# EasyEDA Pro project RK3568_DEV.epro, board PCB1
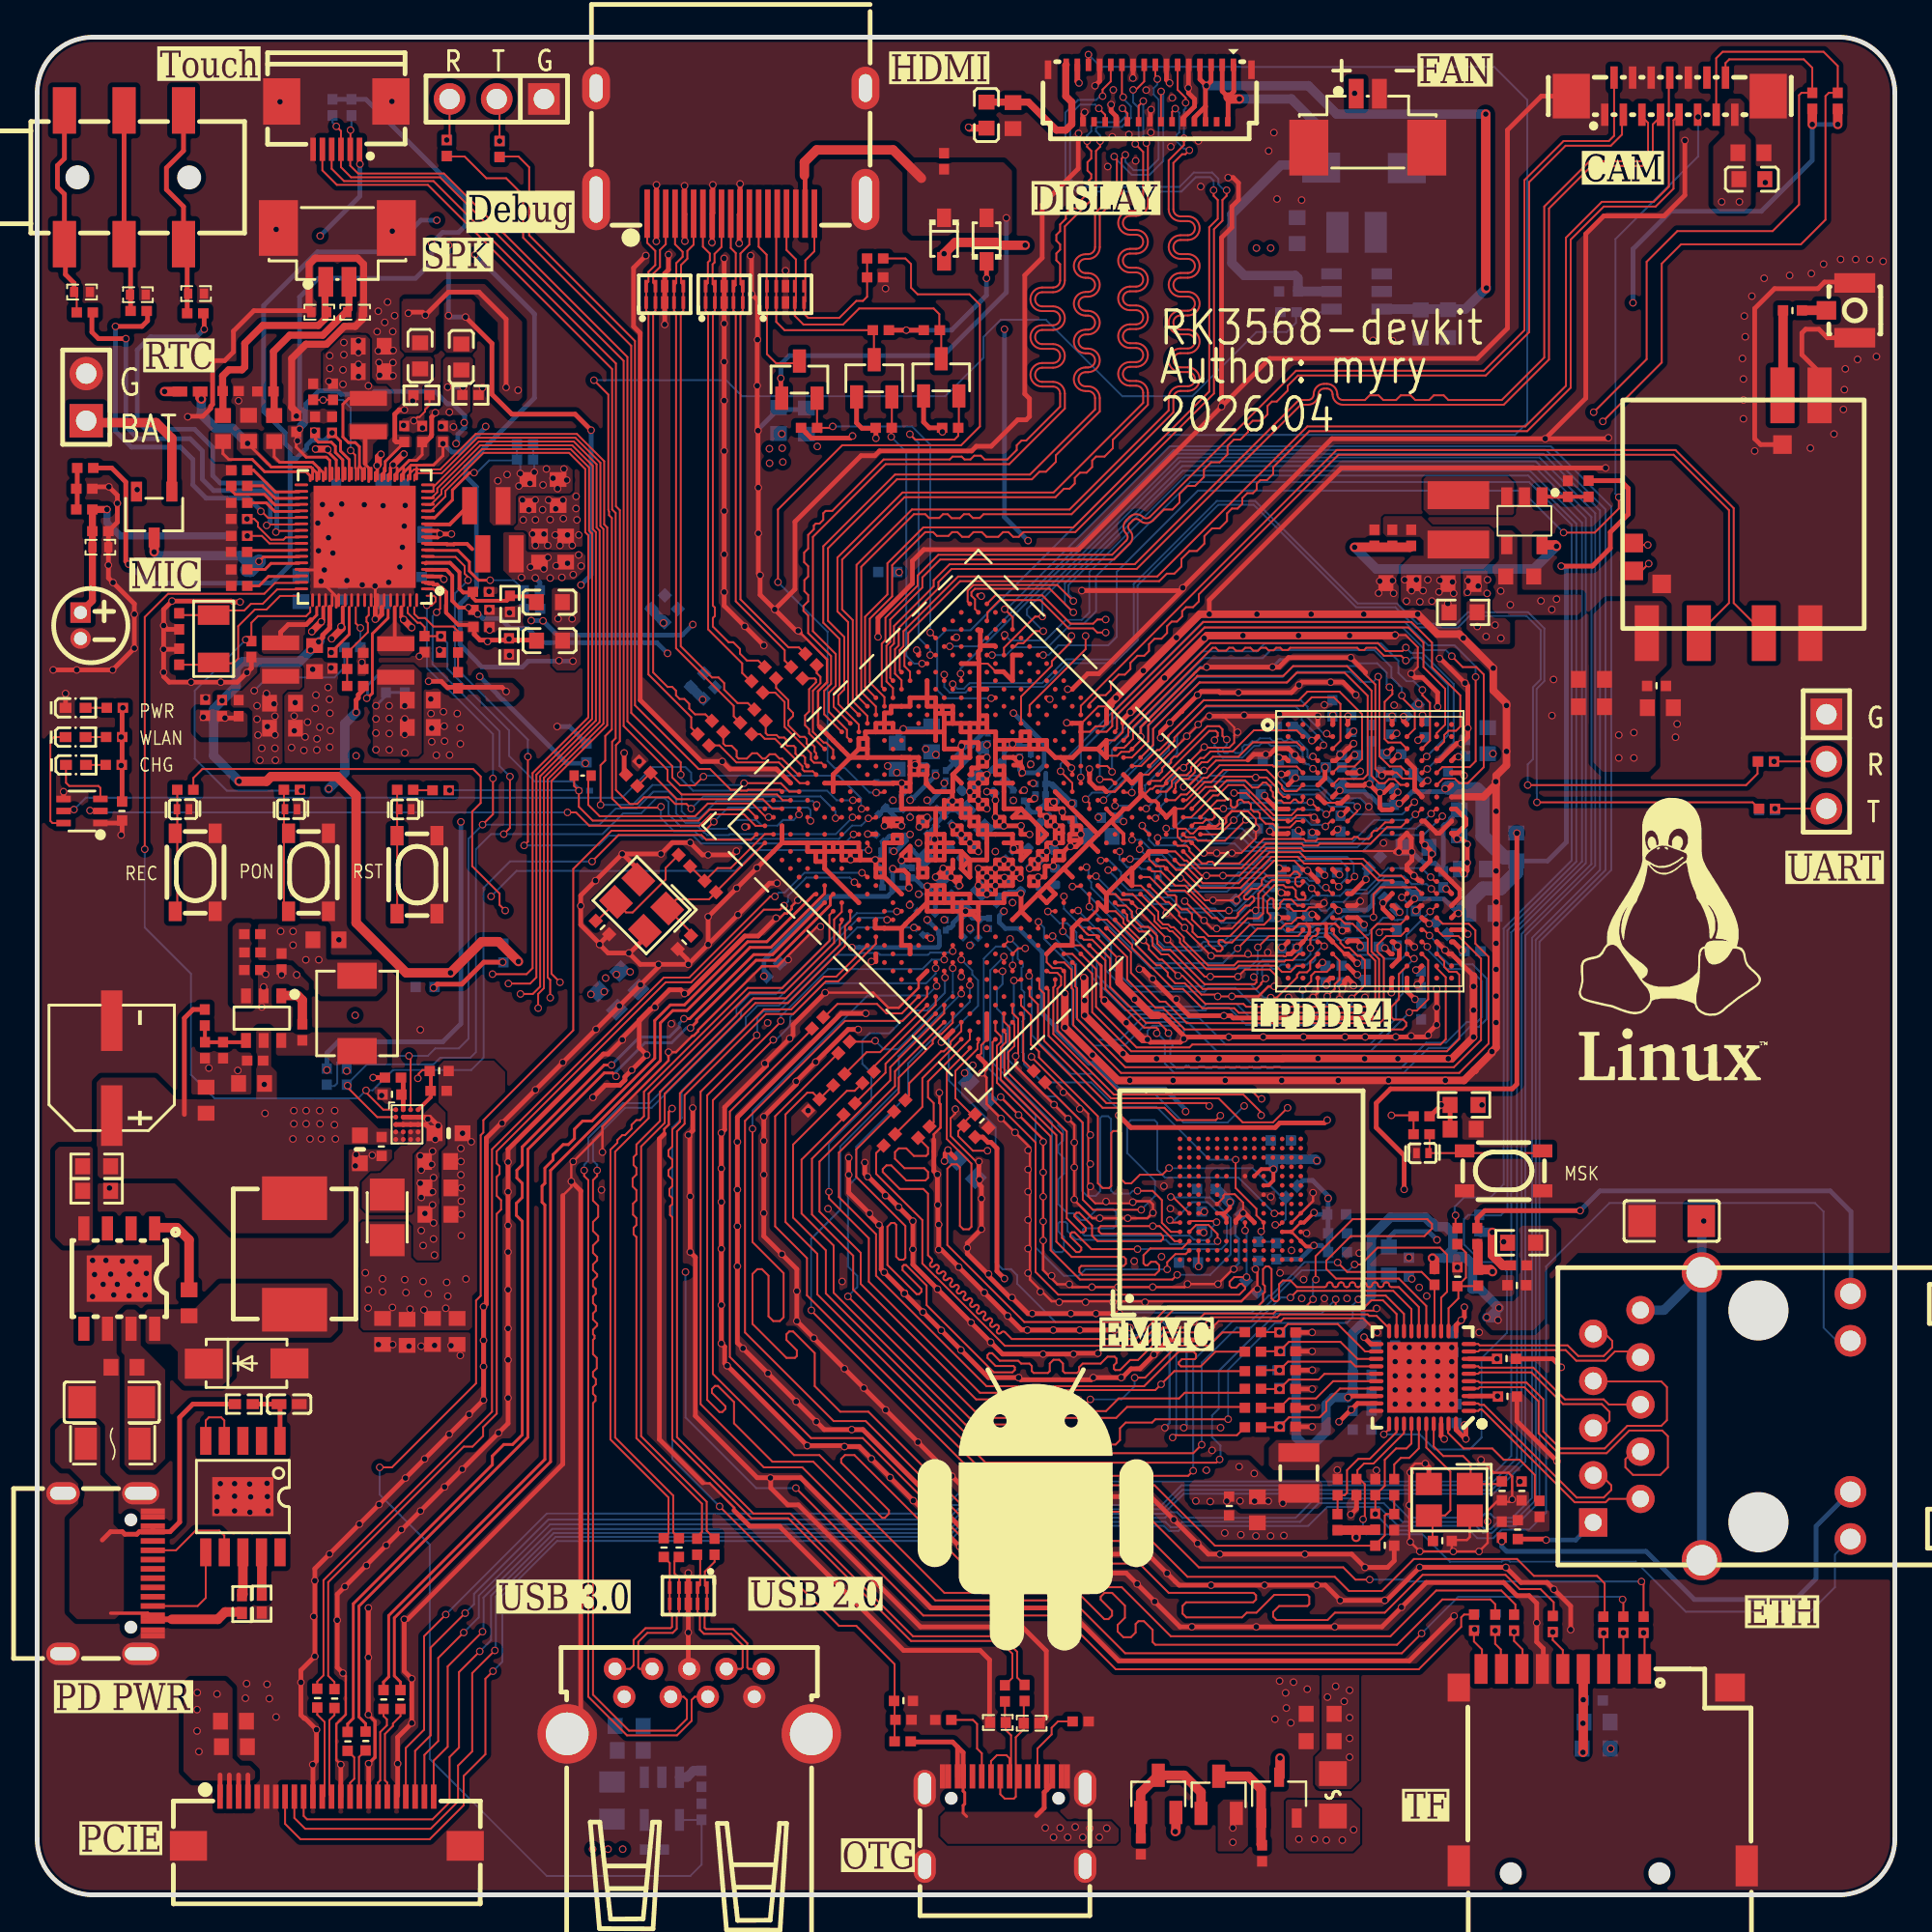
[diagram p27: board, top side]
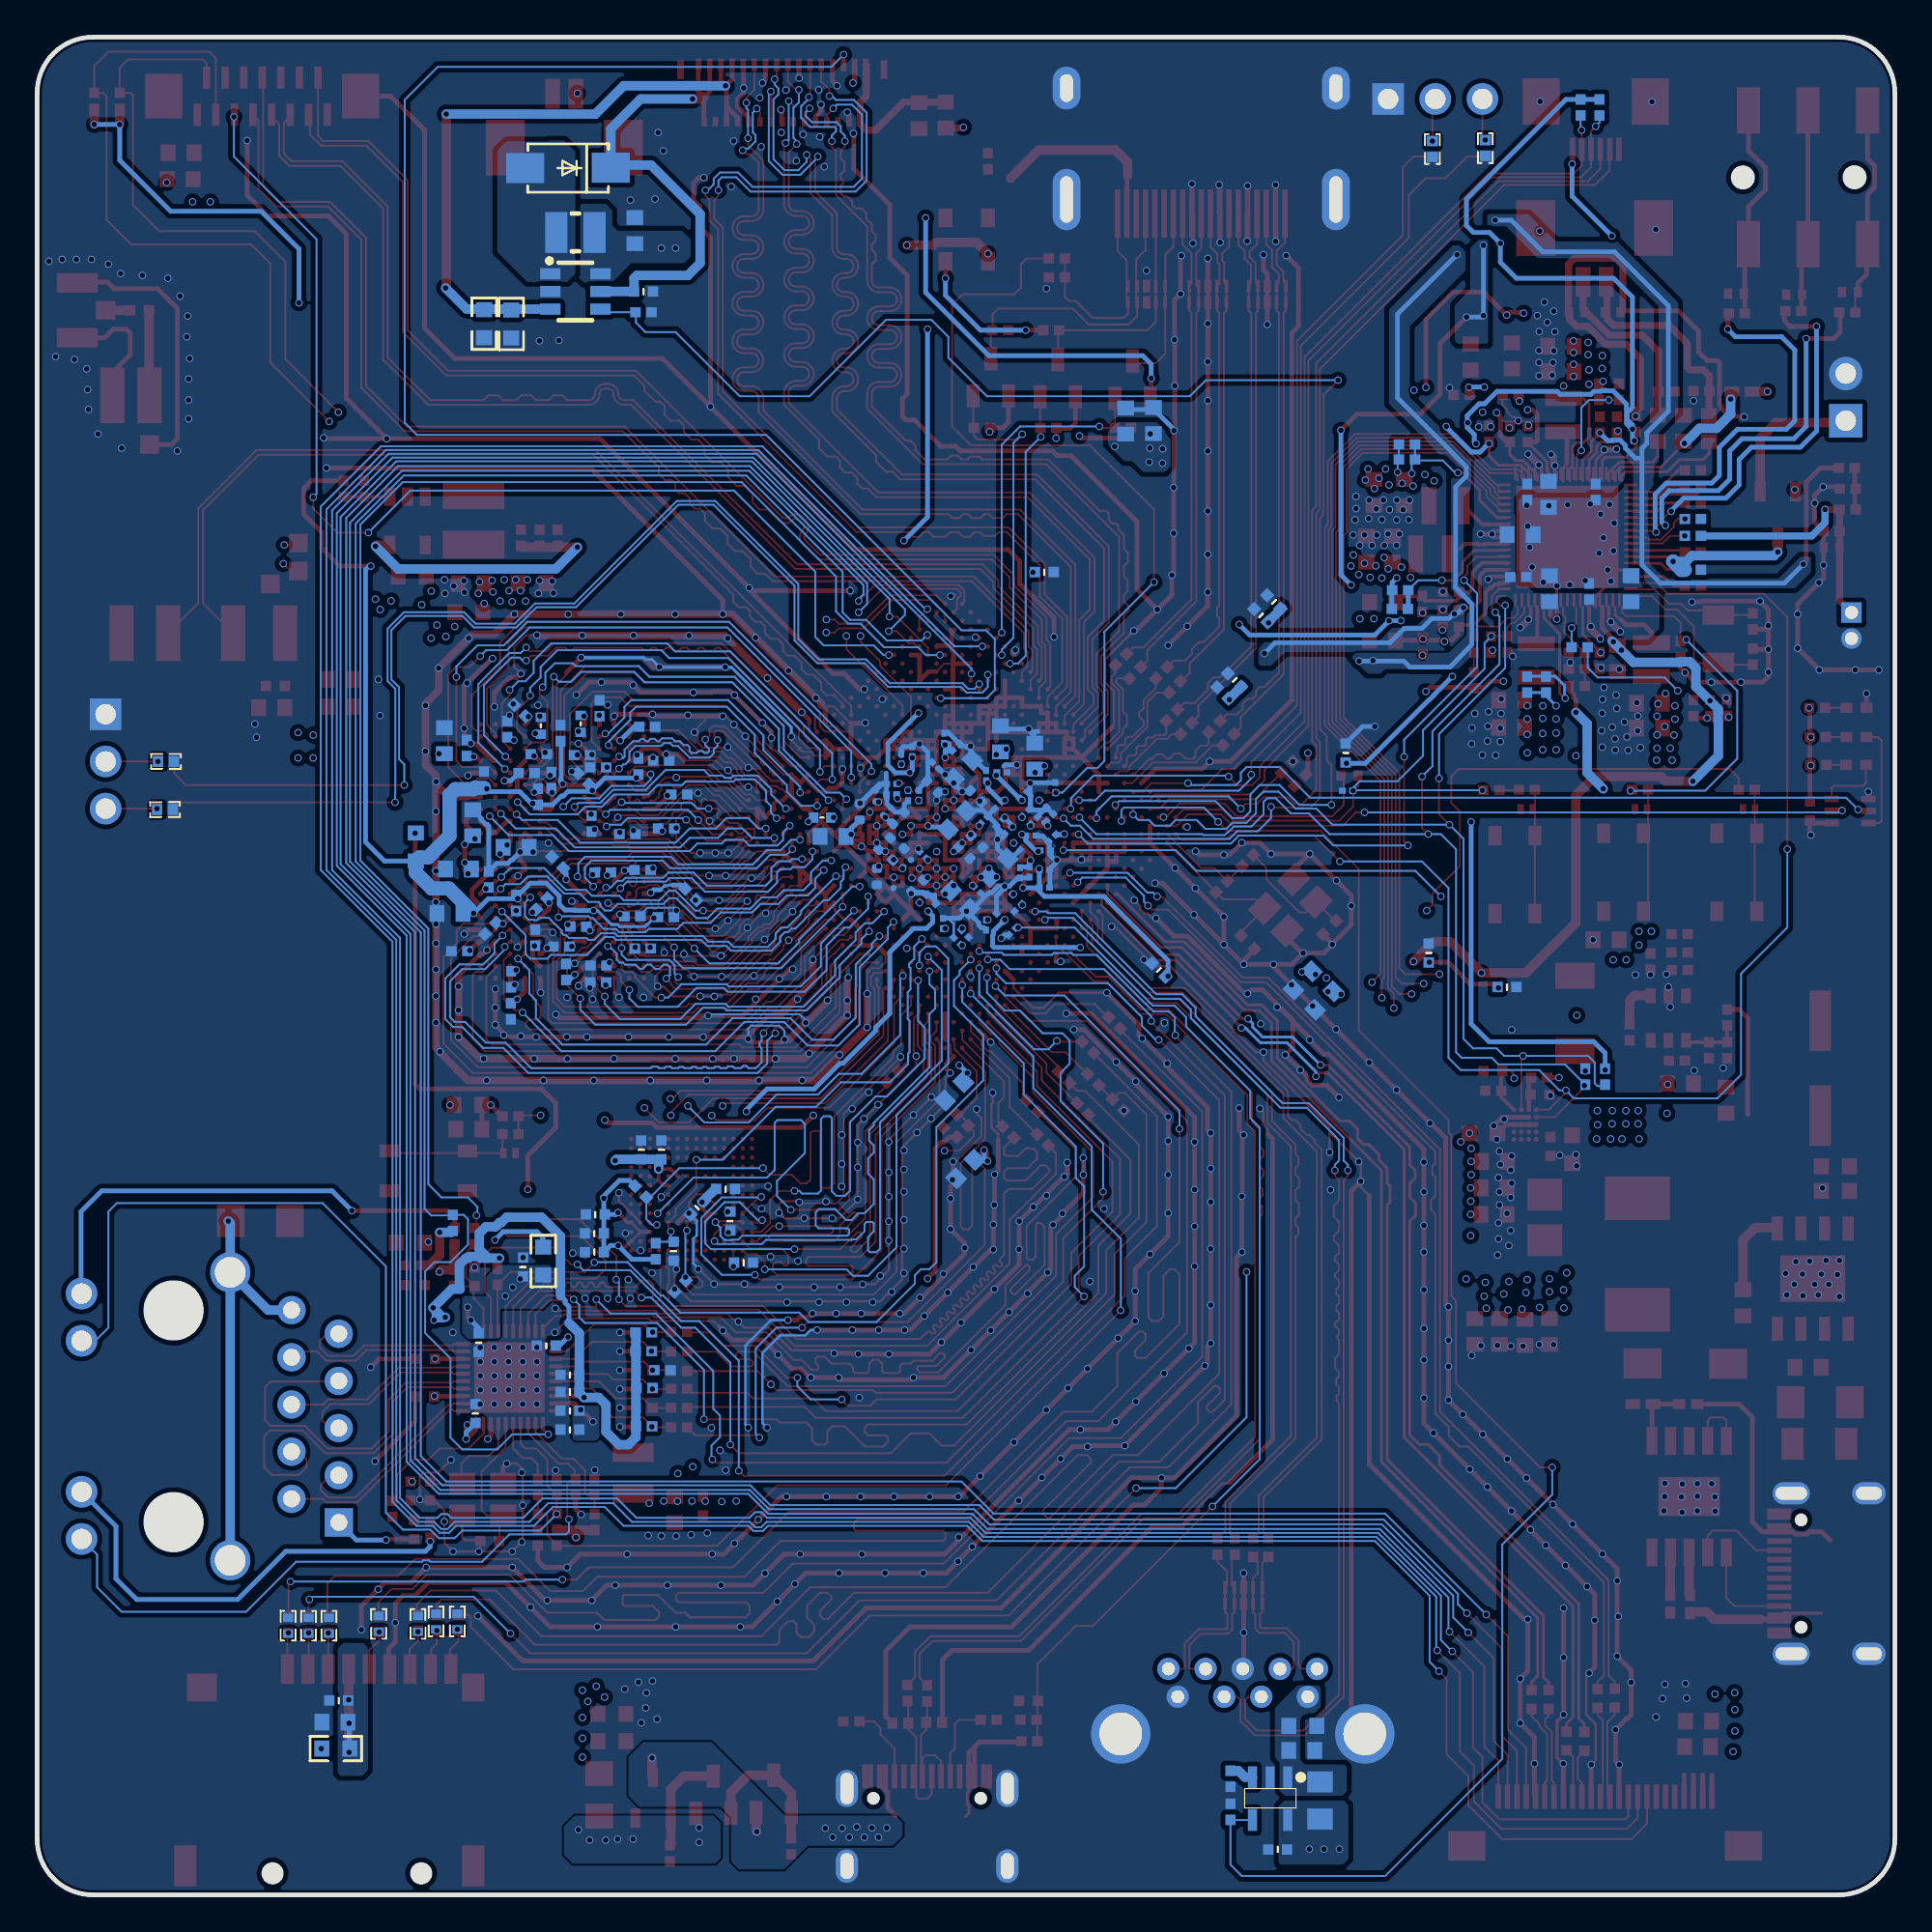
[diagram p28: board, bottom side, seen from below]

Outline 100 x 100 mm; copper layers: Top Layer, GND1, PWR, SIG, GND2, Bottom Layer. Coordinates in mm from the lower left corner of the outline.
Outline path: 0,97 0,3 arc(0.88,0.88) 3,0 97,0 arc(99.12,0.88) 100,3 100,97 arc(99.12,99.12) 97,100 3,100 arc(0.88,99.12) 0,97
Stack: Top Layer 0.035mm Outer layer thickness 1oz / Dielectric1 0.0994mm 3313 RC57% 4.2mil / GND1 0.0152mm Inner layer thickness / Dielectric2 0.55mm 0.55mm H/H No copper / PWR 0.0152mm Inner layer thickness / Dielectric3 0.1088mm 2116 RC54% 4.9mil / SIG 0.0152mm Inner layer thickness / Dielectric4 0.55mm 0.55mm H/H No copper / GND2 0.0152mm Inner layer thickness / Dielectric5 0.0994mm 3313 RC57% 4.2mil / Bottom Layer 0.035mm Outer layer thickness 1oz

## Design rules (mm)
net DDR_A0_A: DDR
net DDR_A_DQS0N: DDR, DP2
net DDR_A_DQS0P: DDR, DP2
net DDR_DM0_A: DDR
net DDR_DQ0_A: DDR
net DDR_DQ1_A: DDR
net DDR_DQ2_A: DDR
net DDR_DQ3_A: DDR
net DDR_DQ4_A: DDR
net DDR_DQ5_A: DDR
net DDR_DQ6_A: DDR
net DDR_DQ7_A: DDR
net DDR_B_DQS0N: DDR, DP5
net DDR_B_DQS0P: DDR, DP5
net DDR_DM0_B: DDR
net DDR_DQ0_B: DDR
net DDR_DQ1_B: DDR
net DDR_DQ2_B: DDR
net DDR_DQ3_B: DDR
net DDR_DQ4_B: DDR
net DDR_DQ5_B: DDR
net DDR_DQ6_B: DDR
net DDR_DQ7_B: DDR
net DDR_A_DQS1N: DDR, DP1
net DDR_A_DQS1P: DDR, DP1
net DDR_DM1_A: DDR
net DDR_DQ8_A: DDR
net DDR_DQ9_A: DDR
net DDR_DQ10_A: DDR
net DDR_DQ11_A: DDR
net DDR_DQ12_A: DDR
net DDR_DQ13_A: DDR
net DDR_DQ14_A: DDR
net DDR_DQ15_A: DDR
net DDR_B_DQS1N: DDR, DP6
net DDR_B_DQS1P: DDR, DP6
net DDR_DM1_B: DDR
net DDR_DQ8_B: DDR
net DDR_DQ9_B: DDR
net DDR_DQ10_B: DDR
net DDR_DQ11_B: DDR
net DDR_DQ12_B: DDR
net DDR_DQ13_B: DDR
net DDR_DQ14_B: DDR
net DDR_DQ15_B: DDR
net DDR_A1_A: DDR
net DDR_A2_A: DDR
net DDR_A3_A: DDR
net DDR_A4_A: DDR
net DDR_A5_A: DDR
net DDR_A_CKE0: DDR
net DDR_A_CKE1: DDR
net DDR_A_CLKN: DDR, DP3
net DDR_A_CLKP: DDR, DP3
net DDR_A_CS0: DDR
net DDR_A_CS1: DDR
net DDR_A_ODTCA: DDR
net DDR_A0_B: DDR
net DDR_A1_B: DDR
net DDR_A2_B: DDR
net DDR_A3_B: DDR
net DDR_A4_B: DDR
net DDR_A5_B: DDR
net DDR_B_CKE0: DDR
net DDR_B_CKE1: DDR
net DDR_B_CLKN: DDR, DP4
net DDR_B_CLKP: DDR, DP4
net DDR_B_CS0: DDR
net DDR_B_CS1: DDR
net DDR_B_ODTCA: DDR
net DDR_RESET: DDR
net CAM0_DN0: DP26
net CAM0_DN1: DP27
net CAM0_DP0: DP26
net CAM0_DP1: DP27
net CAM0_CKN: DP28
net CAM0_CKP: DP28
net HDMI_TX0N_PORT: DP19
net HDMI_TX0P_PORT: DP19
net HDMI_TX1N_PORT: DP18
net HDMI_TX1P_PORT: DP18
net HDMI_TX2N_PORT: DP17
net HDMI_TX2P_PORT: DP17
net HDMI_TXCLKN_PORT: DP20
net HDMI_TXCLKP_PORT: DP20
net LCD_CKN: DP23
net LCD_CKP: DP23
net LCD_D0N: DP21
net LCD_D0P: DP21
net LCD_D1N: DP22
net LCD_D1P: DP22
net LCD_D2N: DP24
net LCD_D2P: DP24
net LCD_D3N: DP25
net LCD_D3P: DP25
net PCIE20_REFCLKN: DP13
net PCIE20_REFCLKP: DP13
net PCIE20_RXN: DP12
net PCIE20_RXP: DP12
net PCIE20_TXN: DP11
net PCIE20_TXP: DP11
net PHY0_MDI_0-: DP10
net PHY0_MDI_0+: DP10
net PHY0_MDI_1-: DP9
net PHY0_MDI_1+: DP9
net PHY0_MDI_2-: DP8
net PHY0_MDI_2+: DP8
net PHY0_MDI_3-: DP7
net PHY0_MDI_3+: DP7
net TYPEC_DM: DP31
net TYPEC_DP: DP31
net USB2_HOST2_DM: DP29
net USB2_HOST2_DP: DP29
net USB3_HOST1_DM: DP36
net USB3_HOST1_DP: DP36
net USB3_HOST1_SSRXN: DP32
net USB3_HOST1_SSRXN_M: DP35
net USB3_HOST1_SSRXP: DP32
net USB3_HOST1_SSRXP_M: DP35
net USB3_HOST1_SSTXN: DP33
net USB3_HOST1_SSTXN_M: DP34
net USB3_HOST1_SSTXP: DP33
net USB3_HOST1_SSTXP_M: DP34
net USB3_OTG0_DM: DP30
net USB3_OTG0_DP: DP30
net $29N965: DP14
net $29N963: DP14
net $29N961: DP15
net $29N959: DP15
net $29N957: DP16
net $29N955: DP16
spacing copperThickness1oz (default): track to track 0.102, other pairs 0.102 to 0.3
spacing copperThickness2oz: track to track 0.203, other pairs 0.152 to 0.3
spacing PWR: track to track 0.102, other pairs 0.102 to 0.3
track width copperThickness1oz (default): min 0.102, default 0.254, max 2.54
track width copperThickness2oz: min 0.203, default 0.254, max 2.54
track width GNDVCC: min 0.102, default 0.254, max 2.54
differential pair differentialPair (default): width min 0.102, default 0.102, max 2.54; gap min 0.152, default 0.152
differential pair PCIE: width min 0.102, default 0.152, max 2.54; gap min 0.152, default 0.203
net GND uses GNDVCC, copperRegion_copperThickness1oz
net MIPI_AVDD_0V9 uses copperRegion_copperThickness1oz
net MIPI_AVDD_1V8 uses copperRegion_copperThickness1oz
net MIPI_CSI_RX_CLK1N uses default
net MIPI_CSI_RX_CLK1P uses default
net MIPI_CSI_RX_D2N uses default
net MIPI_CSI_RX_D2P uses default
net MIPI_CSI_RX_D3N uses default
net MIPI_CSI_RX_D3P uses default
net PCIE20_RXN uses PCIE
net PCIE20_RXP uses PCIE
net PCIE20_TXN uses PCIE
net PCIE20_TXP uses PCIE
net USB_AVDD_0V9 uses copperRegion_copperThickness1oz
net USB_AVDD_1V8 uses copperRegion_copperThickness1oz
net VCC0V6_DDR uses GNDVCC, copperRegion_copperThickness1oz
net VCC1V8_DDR uses GNDVCC
net VCC3V0_RTC uses GNDVCC
net VCC3V3_PHY0 uses GNDVCC
net VCC3V3_PMU uses GNDVCC, copperRegion_copperThickness1oz
net VCC3V3_SD uses GNDVCC, copperRegion_copperThickness1oz
net VCC3V3_SYS uses GNDVCC, PWR, copperRegion_PWR
net VCC_1V8 uses copperRegion_copperThickness1oz
net VCC_3V3 uses copperRegion_copperThickness1oz
net VCC_DDR uses GNDVCC
net VCC-5V uses copperRegion_copperThickness1oz
net VCCA1V8_IMAGE uses GNDVCC, copperRegion_copperThickness1oz
net VCCA1V8_PMU uses GNDVCC, copperRegion_copperThickness1oz
net VCCA_1V8 uses GNDVCC, copperRegion_copperThickness1oz
net VCCIO_ACODEC uses GNDVCC, copperRegion_copperThickness1oz
net VCCIO_FLASH uses GNDVCC
net VCCIO_PHY0 uses GNDVCC, copperRegion_copperThickness1oz
net VCCIO_SD uses GNDVCC, copperRegion_copperThickness1oz
net VCCIO_WL uses GNDVCC, copperRegion_copperThickness1oz
net VDD10_PHY0 uses copperRegion_copperThickness1oz
net VDD_CPU uses GNDVCC
net VDD_GPU uses GNDVCC
net VDD_LOGIC uses GNDVCC
net VDD_NPU uses GNDVCC
net VDDA0V9_IMAGE uses copperRegion_copperThickness1oz
net VDDA0V9_PMU uses copperRegion_copperThickness1oz
net VDDA_0V9 uses copperRegion_copperThickness1oz
diff pair DP11 uses PCIE
diff pair DP12 uses PCIE
pour e10635 uses PWR, copperRegion_PWR
pour e10696 uses PWR, copperRegion_PWR
pour e190 uses PWR, copperRegion_PWR
pour e10698 uses PWR, copperRegion_PWR
pour e10863 uses PWR, copperRegion_PWR
pour e10956 uses PWR, copperRegion_PWR
pour e10959 uses PWR, copperRegion_PWR
pour e11985 uses PWR, copperRegion_PWR
pour e12467 uses PWR, copperRegion_PWR
pour e12497 uses PWR, copperRegion_PWR
pour e12561 uses PWR, copperRegion_PWR
pour e12564 uses PWR, copperRegion_PWR
pour e12571 uses PWR, copperRegion_PWR
pour e12576 uses PWR, copperRegion_PWR
pour e12583 uses PWR, copperRegion_PWR
pour e13712 uses PWR, copperRegion_PWR
pour e13714 uses PWR, copperRegion_PWR
pour e13716 uses PWR, copperRegion_PWR
pour e13719 uses PWR, copperRegion_PWR
pour e13721 uses PWR, copperRegion_PWR
pour e13723 uses PWR, copperRegion_PWR
pour e13731 uses PWR, copperRegion_PWR
pour e13733 uses PWR, copperRegion_PWR
pour e13735 uses PWR, copperRegion_PWR
pour e13738 uses PWR, copperRegion_PWR
pour e13740 uses PWR, copperRegion_PWR
pour e13742 uses PWR, copperRegion_PWR
pour e13746 uses PWR, copperRegion_PWR
pour e13748 uses PWR, copperRegion_PWR
pour e13751 uses PWR, copperRegion_PWR
pour e13757 uses PWR, copperRegion_PWR
pour e13761 uses PWR, copperRegion_PWR
pour e13765 uses PWR, copperRegion_PWR
pour e13767 uses PWR, copperRegion_PWR
pour e13770 uses PWR, copperRegion_PWR
pour e13772 uses PWR, copperRegion_PWR
pour e13774 uses PWR, copperRegion_PWR
pour e13777 uses PWR, copperRegion_PWR
pour e13780 uses PWR, copperRegion_PWR
pour e13785 uses PWR, copperRegion_PWR
pour e13789 uses PWR, copperRegion_PWR
pour e13791 uses PWR, copperRegion_PWR
pour e13793 uses PWR, copperRegion_PWR
pour e13796 uses PWR, copperRegion_PWR
pour e13800 uses PWR, copperRegion_PWR
pour e13803 uses PWR, copperRegion_PWR
pour e13805 uses PWR, copperRegion_PWR
pour e13807 uses PWR, copperRegion_PWR
pour e13809 uses PWR, copperRegion_PWR
pour e13812 uses PWR, copperRegion_PWR
pour e13814 uses PWR, copperRegion_PWR
pour e13816 uses PWR, copperRegion_PWR
pour e13818 uses PWR, copperRegion_PWR
pour e13820 uses PWR, copperRegion_PWR
pour e13822 uses PWR, copperRegion_PWR
pour e13824 uses PWR, copperRegion_PWR
pour e13826 uses PWR, copperRegion_PWR

## Placement (name value [footprint] x y rotation side)
C1  0.1uF  [C0201]  52.31 55.98 225 bottom
C2  22uF  [C0603]  41.41 79.33 270 bottom
C3  22uF  [C0603]  50.31 53.56 45 bottom
C4  100nF  [C0603]  10.57 9.35 180 top
C5  100nF  [C0603]  10.62 7.98 180 top
C6  100nF  [C0201]  49.03 57.86 315 bottom
C7  22uF  [C0603]  48.15 62.23 270 bottom
C8  22uF  [C0603]  50.15 60.6 315 bottom
C9  22uF  [C0603]  39.91 79.36 270 bottom
C10  4.7uF  [MYC0402]  50.1 56.1 45 bottom
C11  100nF  [C0201]  51.62 60.78 225 bottom
C12  4.7uF  [MYC0402]  49.46 59.13 45 bottom
C13  22uF  [C0603]  48.25 55.28 315 bottom
C14  22uF  [C0603]  46.3 61.3 270 bottom
C15  22uF  [C0603]  30.71 48.14 135 bottom
C16  100nF  [C0201]  49.39 54.11 45 bottom
C17  22uF  [C0603]  50.47 57.85 315 bottom
C18  22uF  [C0603]  31.88 49.23 135 bottom
C19  100nF  [MYC0201]  54.87 59.16 270 bottom
C20  22pF  [c0402-nsk]  30.43 52.07 315 top
C21  100nF  [C0201]  29.46 59.44 180 bottom
C22  22pF  [c0402-nsk]  34.84 51.27 45 top
C23  100nF  [C0201]  46.34 57.82 315 bottom
C24  1uF  [c0402-nsk]  33.43 69.6 225 bottom
C25  100nF  [C0201]  46.51 57.03 0 bottom
C26  1uF  [c0402-nsk]  29.57 61.47 270 bottom
C27  100nF  [C0201]  45.36 56.88 135 bottom
C28  1uF  [C0402]  36.18 64.7 225 bottom
C29  100nF  [C0201]  52.53 59.18 270 bottom
C30  100nF  [C0201]  45.49 57.98 315 bottom
C31  1uF  [c0402-nsk]  20.88 48.87 0 bottom
C32  100nF  [C0201]  54.01 59.24 180 bottom
C33  100nF  [C0201]  45.74 56.22 180 bottom
C34  1uF  [c0402-nsk]  34.13 68.86 225 bottom
C35  100nF  [C0201]  48.92 52.2 90 bottom
C36  100nF  [C0201]  51.82 53.14 315 bottom
C37  100nF  [C0201]  47.5 51.87 135 bottom
C38  100nF  [C0201]  48.16 52.63 225 bottom
C39  100nF  [C0201]  47.19 53.14 135 bottom
C40  100nF  [C0201]  47.7 54.05 225 bottom
C41  100nF  [C0201]  53.12 59.17 90 bottom
C42  100nF  [C0201]  54 59.8 180 bottom
C43  100nF  [C0201]  53.49 61.14 270 bottom
C44  100nF  [C0201]  47.09 55.02 90 bottom
C45  4.7uF  [c0402-nsk]  45.79 71.21 0 bottom
C46  100nF  [C0201]  45.78 54.23 0 bottom
C47  4.7uF  [c0402-nsk]  39.62 49.78 225 bottom
C48  100nF  [C0201]  45.77 55.17 0 bottom
C49  100nF  [C0201]  46.58 55.07 90 bottom
C50  4.7uF  [c0402-nsk]  25.09 50.7 270 bottom
C51  4.7uF  [c0402-nsk]  35.54 65.39 225 bottom
C52  100nF  [C0201]  51.17 62.26 270 bottom
C53  100nF  [C0201]  50.06 51.74 45 bottom
C54  100pF  [c0402-nsk]  15.08 10.59 270 top
C55  22uF  [C0603_1]  21.57 38.05 180 top
C56  100nF  [C0201]  50.47 51.33 225 bottom
C57  100nF  [C0201]  51.24 52.29 270 bottom
C58  100nF  [C0201]  45.19 59.6 270 bottom
C59  22uF  [C0603_1]  21.57 36.63 180 top
C60  100nF  [C0201]  47.73 57.3 135 bottom
C61  1uF  [C0201]  48.19 57.74 135 bottom
C62  22uF  [C0603_1]  21.55 39.48 180 top
C63  100nF  [C0201]  46.8 58.25 315 bottom
C64  100nF  [C0201]  48.25 58.67 135 bottom
C65  10uF  [C0603_1]  18.59 70.31 90 bottom
C66  100nF  [C0201]  46.88 59.2 315 bottom
C67  10uF  [C0603_1]  14.94 66.55 270 top
C68  100nF  [C0201]  48.92 60.25 270 bottom
C69  100nF  [C0201]  48.07 60.43 0 bottom
C70  100nF  [C0201]  52.89 61.54 270 bottom
C71  100nF  [C0201]  50.54 61.77 315 bottom
C72  100nF  [C0201]  52.31 53.63 315 bottom
C73  1uF  [R0402_1]  19.79 75.51 90 bottom
C74  1uF  [R0402_1]  19.76 78.64 90 top
C75  22uF  [C0603_1]  20.17 73.23 0 bottom
C76  10uF  [C0603_2]  11.38 78.94 270 top
C77  1uF  [R0402_1]  20.73 78.64 90 top
C78  1uF  [R0402_1]  21.84 78.64 90 top
C79  1uF  [R0402_1]  16.1 75.51 90 bottom
C80  1uF  [R0402_1]  15.87 79.13 90 top
C81  1uF  [R0402_1]  26.26 78.08 0 bottom
C82  10uF  [C0603_2]  26.42 75.49 90 top
C83  10uF  [C0603_2]  20.62 64.31 180 top
C84  22uF  [C0603_1]  28.04 75.49 270 top
C85  22uF  [C0603_1]  20.62 62.84 0 top
C86  1uF  [R0402_1]  19.79 65.15 270 bottom
C87  1uF  [R0402_1]  14.96 79.13 90 top
C88  1uF  [R0402_1]  13.94 79.18 90 top
C89  1uF  [R0402_1]  20.27 70.94 0 bottom
C90  1uF  [R0402_1]  23.91 68.26 0 top
C91  10uF  [C0603_2]  18.64 75.39 90 bottom
C92  1uF  [R0402_1]  23.91 69.17 0 top
C93  1uF  [R0402_1]  23.89 70.14 0 top
C94  10uF  [C0603_2]  27.04 72.44 270 top
C95  1uF  [R0402_1]  16.46 70.15 270 bottom
C96  1uF  [R0402_1]  15.9 66.45 270 top
C97  1uF  [R0402_1]  26.62 70.23 180 bottom
C98  22uF  [C0603_1]  28.45 72.44 90 top
C99  10uF  [C0603_2]  17.98 83.36 180 top
C100  100nF  [R0402_1]  48.82 93.32 270 top
C101  22uF  [C0603_1]  17.98 81.99 0 top
C102  10uF  [C0603_2]  14.2 70.31 270 bottom
C103  22uF  [C0603_1]  13.21 62.8 0 top
C104  10uF  [C0603_2]  13.21 64.15 180 top
C105  1uF  [R0402_1]  9.04 63.91 270 top
C106  1uF  [R0402_1]  10.88 71.35 0 top
C107  1uF  [R0402_1]  10.87 71.32 180 bottom
C108  1uF  [c0402-nsk]  67.36 86.31 0 bottom
C109  4.7uF  [R0402_1]  10.88 75.84 180 top
C110  100nF  [c0402-nsk]  4.57 58.34 90 top
C111  100nF  [R0402_3]  23.33 80.74 180 top
C112  12pF  [R0402_2]  7.65 68.55 90 top
C113  1uF  [R0402_1]  10.88 74.93 0 top
C114  1uF  [R0402_1]  10.88 76.69 0 top
C115  100nF  [R0402_3]  25.4 67.21 90 top
C116  12pF  [R0402_2]  7.65 66.65 90 top
C117  1uF  [R0402_1]  10.88 70.46 0 top
C118  1uF  [R0402_1]  10.87 72.29 0 top
C119  100nF  [R0402_3]  20.69 80.72 180 top
C120  680pF  [R0402_1]  12.29 80.93 0 top
C121  680pF  [R0402_1]  10.42 80.95 180 top
C122  100nF  [R0402_3]  25.45 69.49 90 top
C123  100nF  [R0402_1]  10.87 73.15 180 bottom
C124  27pF  [R0402_1]  10.88 73.15 0 top
C125  27pF  [R0402_1]  10.88 74.07 0 top
C126  100nF  [R0402_1]  17.12 66.85 180 top
C127  100nF  [R0402_1]  20.85 67.32 90 top
C128  100nF  [R0402_1]  11.53 67.06 270 top
C129  100nF  [R0402_1]  10.87 74.07 180 bottom
C130  22uF  [c0603-nsk]  17.37 40.13 90 top
C131  100nF  [c0402-nsk]  18.54 40.28 90 top
C132  1uF  [c0402-nsk]  21.64 44.35 0 top
C133  100nF  [R0603]  69.06 8.27 0 top
C134  22uF  [c0603-nsk]  22.15 41 0 top
C135  100nF  [c0402-nsk]  79.65 32.82 180 top
C136  100nF  [c0402-nsk]  71.32 26.06 0 bottom
C137  100nF  [c0402-nsk]  19.1 43.08 0 top
C138  100nF  [C0603]  76.76 41.22 180 top
C139  10uF  [C0603_2]  77.77 52.83 180 bottom
C140  100nF  [R0402_1]  74.21 53.4 90 bottom
C141  100nF  [R0402_1]  70.59 60.08 225 bottom
C142  100nF  [R0402_1]  67.63 60.74 270 bottom
C143  100nF  [R0402_1]  66.15 52.63 0 bottom
C144  100nF  [R0402_1]  73.04 59.11 270 bottom
C145  100nF  [R0402_1]  75.95 60.03 270 bottom
C146  22uF  [C0603_1]  76.56 57.71 270 bottom
C147  10uF  [C0603_2]  77.32 55.22 180 bottom
C148  10uF  [C0603_2]  74.22 56.39 0 bottom
C149  1uF  [R0402_1]  70.87 52.12 0 bottom
C150  100nF  [R0402_1]  68.22 57.1 180 bottom
C151  100nF  [R0402_1]  69.55 55.04 0 bottom
C152  100nF  [R0402_1]  64.82 53.85 225 bottom
C153  100nF  [R0402_1]  75.69 54.66 90 bottom
C154  100nF  [R0402_1]  66.14 57.4 180 bottom
C155  100nF  [R0402_1]  71.83 62.53 90 bottom
C156  100nF  [R0402_1]  72.32 60 90 bottom
C157  100nF  [R0402_1]  74.02 63.75 45 bottom
C158  100nF  [R0402_1]  69.73 63.88 90 bottom
C159  100nF  [R0402_1]  65.43 59.23 180 bottom
C160  100nF  [R0402_1]  67.41 55.17 0 bottom
C161  100nF  [R0402_1]  70.15 57.66 270 bottom
C162  100nF  [R0402_1]  71.98 55.58 45 bottom
C163  100nF  [R0402_1]  72.85 53.34 315 bottom
C164  100nF  [R0402_1]  69.8 49.12 0 bottom
C165  100nF  [R0402_1]  74.5 47.56 270 bottom
C166  22uF  [C0603_1]  78.08 62.13 270 bottom
C167  10uF  [R0402_1]  77.27 50.8 180 bottom
C168  10uF  [R0402_1]  67.16 62.88 0 bottom
C169  100nF  [R0402_1]  74.48 49.29 270 bottom
C170  100nF  [R0402_1]  73.65 60.39 180 bottom
C171  100nF  [R0402_1]  67.96 52.67 180 bottom
C172  100nF  [R0402_1]  67.4 50.94 0 bottom
C173  100nF  [R0402_1]  71.78 51.04 0 bottom
C174  100nF  [R0402_1]  69.8 60.69 0 bottom
C175  100nF  [R0402_1]  71.53 49.68 90 bottom
C176  100nF  [R0402_1]  73.19 51.52 90 bottom
C177  100nF  [R0402_1]  75.59 52.02 315 bottom
C178  100nF  [R0402_1]  69.78 50.02 0 bottom
C179  100nF  [R0402_1]  74.69 62.75 90 bottom
C180  100nF  [R0402_1]  76.88 61.73 90 bottom
C181  100nF  [R0402_1]  73 61.4 180 bottom
C182  100nF  [R0402_1]  70.67 61.35 180 bottom
C183  100nF  [R0402_1]  66.41 61.05 180 bottom
C184  100nF  [c0402-nsk]  69.95 36.63 0 bottom
C185  4.7uF  [c0402-nsk]  70 35.61 0 bottom
C186  100nF  [c0402-nsk]  70 34.59 180 bottom
C187  4.7uF  [c0402-nsk]  62.69 36.27 90 bottom
C188  2.2uF  [c0402-nsk]  61.98 34.04 0 bottom
C189  100nF  [c0402-nsk]  62.94 38 0 bottom
C190  4.7uF  [c0402-nsk]  66.4 40.1 270 bottom
C191  100nF  [c0402-nsk]  67.49 40.1 270 bottom
C192  4.7uF  [c0402-nsk]  64.46 36.98 135 bottom
C193  100nF  [c0402-nsk]  65.73 34.65 90 bottom
C194  100nF  [c0402-nsk]  73.84 33.8 90 bottom
C195  100nF  [R0402_1]  11.73 44.91 0 top
C196  100nF  [R0402_1]  13.16 50.24 270 top
C197  1uF  [R0402_1]  2.54 75.69 0 top
C198  220pF  [R0402_1]  3.4 73.41 0 top
C199  1uF  [C0402_1]  13.56 26.42 0 top
C200  1nF  [c0402-nsk]  50.85 41.66 315 top
C201  100pF  [c0402-nsk]  16 10.57 270 top
C202  100nF  [c0402-nsk]  16.71 8.26 270 top
C203  NC  [R0603_1]  79.81 70.97 180 top
C204  NC  [R0402_1]  82.4 75.69 90 top
C205  NC  [R0402_1]  73.96 73.05 90 top
C206  NC  [R0603_1]  73.36 70.61 180 top
C207  22uF  [C0603_1]  76.64 70.58 0 top
C208  100nF  [c0402-nsk]  17.68 8.28 270 top
C209  100nF  [c0402-nsk]  18.64 10.52 270 top
C210  100nF  [c0402-nsk]  19.56 10.52 270 top
C211  10uF  [C0603]  87.38 63.91 180 top
C212  22uF  [C0603]  83.67 65.43 0 top
C213  10uF  [R0603]  69.06 9.74 0 top
C214  22uF  [C0603]  83.67 63.96 0 top
C215  22uF  [C0603_1]  18.59 30.33 270 top
C216  22uF  [C0603_1]  21.28 30.33 270 top
C217  22uF  [C0603_1]  19.91 30.28 270 top
C218  22uF  [C0603_1]  22.61 30.33 270 top
C219  1uF  [MYC0402]  49.41 56.7 45 bottom
C220  1uF  [MYC0402]  51.8 59.64 225 bottom
C221  100nF  [MYC0201]  53.91 54.48 90 bottom
C222  4.7uF  [MYC0402]  55.72 58.3 270 bottom
C223  4.7uF  [MYC0402]  54.8 54.81 90 bottom
C224  10uF  [C0603]  57.16 56.97 180 bottom
C225  100nF  [MYC0201]  53.17 55.52 315 bottom
C226  100nF  [MYC0201]  54.26 58.32 315 bottom
C227  4.7uF  [MYC0402]  53.63 57.97 315 bottom
C228  4.7uF  [MYC0402]  53.64 56.01 315 bottom
C229  4.7uF  [MYC0402]  54.39 56.59 315 bottom
C234  4.7uF  [C0603]  67.83 89.59 270 bottom
C238  1uF  [c0402-nsk]  33.22 2.44 180 bottom
C239  100nF  [R0603_1]  31.87 9.09 0 bottom
C240  10uF  [C0603_2]  31.92 7.77 0 bottom
C244  4.7uF  [MYC0402]  52.61 54.31 135 bottom
C336  100nF  [R0402_1]  10.01 45.47 90 top
C337  100nF  [R0402_1]  14.27 46.43 90 top
C338  22pF  [R0402_1]  11.59 50.73 0 top
C339  22uF  [C0603_1]  15.55 51.41 180 top
C341  10uF  [C0603_2]  11.54 43.68 0 top
C342  22uF  [C0603]  50.04 39.07 135 bottom
C343  22uF  [C0603]  50.63 43.26 135 bottom
C345  1nF  [C1206]  87.99 36.27 0 top
C346  10nF  [c0402-nsk]  79.7 19.66 90 top
C347  100nF  [c0402-nsk]  76.45 33.27 270 top
C348  18pF  [c0402-nsk]  78.85 21.75 270 top
C349  18pF  [c0402-nsk]  75.64 19.05 0 top
C350  18pF  [c0402-nsk]  72.54 18.8 0 top
C351  4.7uF  [C0603]  65.68 20.73 90 top
C352  100nF  [c0402-nsk]  64.16 20.93 270 top
C353  100nF  [c0402-nsk]  72.59 29.57 0 bottom
C354  100nF  [c0402-nsk]  79.15 26.82 0 top
C355  100nF  [c0402-nsk]  79.1 28.85 0 top
C356  100nF  [c0402-nsk]  79.91 21.74 270 top
C359  100nF  [c0402-nsk]  76.24 29.73 270 bottom
C360  100nF  [c0402-nsk]  71.32 25.04 0 bottom
C361  100nF  [c0402-nsk]  76.4 25.91 90 bottom
C363  100nF  [c0402-nsk]  71.32 27.99 0 bottom
C364  100nF  [c0402-nsk]  71.32 27.08 0 bottom
C498  100nF  [c0402-nsk]  46.63 10.44 0 top
C510  100nF  [C0603]  92.25 93.78 180 top
C514  10uF  [C0603]  83.97 9.3 180 bottom
C515  100nF  [c0402-nsk]  83.77 10.46 0 bottom
C528  100nF  [c0402-nsk]  87.17 65.07 0 top
C530  2.7PF  [c0402-nsk]  94.49 85.29 180 top
C536  10nF  [C0603]  8.18 31.87 270 top
C537  100uF  [CAP-SMD_BD6.3-L6.6-W6.6-RD]  4.01 44.5 270 top
C538  100nF  [C0603]  9.09 42.77 270 top
C539  10uF  [C1206]  4.01 26.52 0 top
C540  100nF  [C0603]  4.67 28.4 0 top
C541  1uF  [c0402-nsk]  33.73 18.69 270 top
C542  1uF  [c0402-nsk]  34.54 18.69 270 top
C543  100nF  [C0603]  52.53 95.78 90 top
CARD1  TF PUSH  [TF-SMD_TF-PUSH]  84.28 6.86 0 top
CN3  PJ-313D  [AUDIO-SMD_PJ-313D-2]  4.67 92.46 90 top
D1  BAT54C,215  [SOT-23-3_L2.9-W1.6-P1.90-LS2.8-BR]  6.3 74.3 90 top
D2  ESD73034D  [DFN-10_L2.5-W1.0-P0.50-BL-2]  33.78 86.16 0 top
D3  ESD73034D  [DFN-10_L2.5-W1.0-P0.50-BL-2]  40.28 86.16 0 top
D6  SS34  [SMA_L4.3-W2.6-LS5.0-FD]  11.28 28.6 180 top
D27  B5819WS-TP  [SOD-323_L1.8-W1.3-LS2.5-RD]  51.11 89.1 90 top
D28  B5819WS-TP  [SOD-323_L1.8-W1.3-LS2.5-RD]  48.82 89.1 270 top
D29  ESD73034D  [DFN-10_L2.5-W1.0-P0.50-BL-2]  36.98 86.16 0 top
D30  ESD73034D  [DFN-10_L2.5-W1.0-P0.50-BL-2]  35.05 16.1 180 top
D32  SS34  [SMA_L4.3-W2.6-LS5.0-FD]  71.42 92.96 180 bottom
F2  BSMD0805L-200  [F0805]  69.75 5.38 90 top
FPC1  HC-FPC-03-09-31RLTAG  [FPC-SMD_31P-P0.30_HC-FPC-03-09-31RLTAG]  59.89 96.98 0 top
FPC2  FPC-05F-6PH20  [FPC-SMD_6P-P0.50_XUNPU_FPC-05F-6PH20]  16.1 95.25 180 top
FPC3  AFC01-S24FCA-00  [FPC-SMD_24P-P0.50_AFC01-S24FCA-00]  15.6 3.96 0 top
H1  -  [HDR-TH_3P-P2.54-V-M]  24.74 96.67 180 top
H2  -  [HDR-TH_3P-P2.54-V-M]  96.32 61.01 270 top
H5  -  [HDR-TH_2P-P2.54-V-M-1]  2.64 80.62 90 top
HDMI1  HDMI 19PIN 043  [HDMI-SMD_HDMI-19PIN-043]  37.34 93.88 180 top
L1  470nH  [IND-SMD_L2.0-W1.6_MHCHL201610A-1R0M-Q8A]  24.18 74.78 180 top
L2  470nH  [IND-SMD_L2.0-W1.6_MHCHL201610A-1R0M-Q8A]  19.3 66.45 270 top
L3  470nH  [IND-SMD_L2.0-W1.6_MHCHL201610A-1R0M-Q8A]  24.89 72.19 180 top
L4  470nH  [IND-SMD_L2.0-W1.6_MHCHL201610A-1R0M-Q8A]  17.83 79.65 90 top
L5  470nH  [IND-SMD_L2.0-W1.6_MHCHL201610A-1R0M-Q8A]  13.11 66.5 270 top
L6  BLM15AG121SN1D  [L0402]  8.23 80.92 0 top
L7  BLM18PG121SN1D  [L0603_1]  22.83 82.78 90 top
L8  BLM18PG181SN1D  [L0603]  10 78.93 90 top
L9  BLM18PG121SN1D  [L0603_1]  27.58 67.51 0 top
L10  BLM18PG181SN1D  [L0603]  12.76 78.93 90 top
L11  BLM18PG121SN1D  [L0603_1]  20.61 82.84 90 top
L12  BLM18PG121SN1D  [L0603_1]  27.57 69.58 0 top
L13  240nH  [IND-SMD_L2.5-W2.0_WPN252012H]  18.84 36.47 90 top
L14  15uH  [IND-SMD_L7.3-W6.8]  13.86 34.5 90 top
L16  10uH  [IND-SMD_L2.5-W2.0]  71.03 89.49 0 bottom
L17  NC  [IND-SMD_L3.0-W3.0]  76.51 74.02 90 top
L18  3.3uH  [IND-SMD_L4.4-W4.2]  17.22 47.45 270 top
L19  HR911130C  [RJ45-TH_HR911130C]  90.69 25.76 270 top
L20  2.2uH  [IND-SMD_L2.5-W2.0_MHCHL2520]  67.92 22.71 270 top
L23  BLM18PG121SN1D  [L0603_1]  92.3 92.35 180 top
L24  BLM18PG121SN1D  [L0603_1]  51.1 95.8 90 top
MIC1  GMI4015P-2C-42db  [MIC-TH_BD4.0-P1.40-D0.4-L-FD]  2.34 68.33 270 top
PW  -  [LED_0402]  2.07 63.9 0 top
PW1  -  [LED_0402]  2.09 60.83 0 top
PW2  -  [LED_0402]  2.07 62.32 0 top
PWR  -  [Key_SMD_4.2x3.2x2.5]  14.6 55.04 90 top
Q1  PUMH9,115  [SOT-363_L2.0-W1.3-P0.65-LS2.1-BL]  2.41 58.34 90 top
Q2  -  [SOT-23-3_L2.9-W1.3-P1.90-LS2.4-BR]  48.67 81.69 270 top
Q3  -  [SOT-23-3_L2.9-W1.3-P1.90-LS2.4-BR]  41.03 81.57 270 top
Q4  -  [SOT-23-3_L2.9-W1.3-P1.90-LS2.4-BR]  45.06 81.64 270 top
Q5  CJ2301 S1  [SOT-23-3_L3.0-W1.7-P0.95-LS2.9-BR]  66.85 5.23 270 top
Q6  MMBT5401  [SOT-23-3_L2.9-W1.3-P1.90-LS2.4-BR]  60.35 5.44 270 top
Q7  MMBT5401  [SOT-23-3_L2.9-W1.3-P1.90-LS2.4-BR]  63.6 5.38 270 top
R1  22  [R0402#2]  34.84 55.67 315 top
R2  0Ω  [r0402-nsk]  29.36 60.25 180 top
R3  1M  [R0402#2]  36.24 54.27 135 top
R4  4.7K  [R0402#2]  77.57 33.22 270 top
R5  0  [R0402#2]  76.45 35.46 270 top
R6  100  [R0402#2]  73.05 21.95 90 top
R7  120  [R0402#2]  73.05 20.07 90 top
R8  120Ω  [r0402-nsk]  57.75 57.99 0 bottom
R9  2.2  [R0402#2]  36.63 62.89 135 top
R10  100  [R0402#2]  2.59 76.81 180 top
R11  4.7K  [R0402#2]  41.81 42.52 45 top
R12  200  [R0201]  47.24 56.44 225 bottom
R13  22  [R0402#2]  45.87 40.64 45 top
R14  22  [R0402#2]  46.43 42.47 45 top
R15  22  [R0402#2]  43.72 42.3 45 top
R16  22  [R0402#2]  44.73 44.01 45 top
R17  22  [R0402#2]  43.16 43.88 45 top
R18  22  [R0402#2]  42.01 46.94 45 top
R19  2.2  [R0402#2]  35.86 62.18 135 top
R20  22  [R0402#2]  43.43 45.62 45 top
R21  2.2  [R0402#2]  38.15 62.79 135 top
R22  22  [R0402#2]  47.73 41.05 45 top
R23  10K  [R0402#2]  50.19 41.1 315 top
R24  4.7K  [R0402#2]  67.31 25.2 180 top
R25  4.7K  [R0402#2]  67.3 27.29 0 bottom
R26  4.7K  [R0402#2]  67.31 27.23 180 top
R27  22  [R0402#2]  74.52 40.94 0 top
R28  4.7K  [R0402#2]  67.31 28.24 180 top
R29  4.7K  [R0402#2]  67.36 29.26 0 bottom
R30  4.7K/nc  [R0402#2]  67.31 29.26 180 top
R31  4.7K/nc  [R0402#2]  66.34 28.24 180 bottom
R32  1.62K  [R0201]  45.84 58.74 225 bottom
R33  2.2  [R0402#2]  38.91 63.5 135 top
R34  2.2  [R0402#2]  38.76 65.02 135 top
R35  2.2  [R0402#2]  39.47 65.79 135 top
R36  2.2  [R0402#2]  40.89 65.79 135 top
R37  2.2  [R0402#2]  41.66 66.5 135 top
R38  0  [R0603]  76.76 69.04 180 top
R40  100  [R0402#2]  93.07 61.01 180 top
R41  100  [R0402#2]  93.12 58.47 180 top
R42  22  [R0402#2]  53.95 44.04 315 top
R43  2.2k  [R0402#2]  2.54 74.57 180 top
R44  24kΩ  [R0402]  12.09 15.68 270 top
R45  1kΩ  [R0402]  11.12 26.42 0 top
R46  10kΩ  [R0402]  11.03 15.65 270 top
R47  100  [R0402#2]  7.98 59.49 0 top
R48  51kΩ  [R0402#2]  65.94 2.24 90 top
R49  10kΩ  [R0402#2]  59.41 2.62 90 top
R50  0402WGF1000TCE  [R0402_1]  26.26 77.27 0 bottom
R51  0402WGF1000TCE  [R0402_1]  18.78 65.15 270 bottom
R52  0Ω  [R0402_1]  10.85 63.88 270 top
R53  0402WGF1000TCE  [R0402_1]  26.64 69.22 180 bottom
R54  0Ω  [R0402_1]  9.96 63.88 270 top
R55  47kΩ  [R0402_1]  15.93 80.91 270 top
R56  120kΩ  [R0402_1]  14.86 80.91 270 top
R57  0Ω  [R0402_1]  16.97 67.16 180 bottom
R59  180kΩ  [R0402_1]  17.12 65.07 0 top
R60  10kΩ  [R0402_1]  22.66 65.38 90 top
R61  0Ω  [R0402_1]  22.66 67.31 90 top
R62  56kΩ  [R0402_1]  17.12 65.99 180 top
R63  10kΩ  [R0402_1]  21.74 67.31 90 top
R64  22  [R0402#2]  21.72 59.46 0 top
R65  100Ω  [R0402#2]  21.61 43.28 0 top
R66  51kΩ  [R0402#2]  19.15 43.99 180 top
R67  10K  [R0402#2]  32 59.99 135 top
R68  0  [R0603]  76.81 42.52 180 top
R69  2.2K  [R0402#2]  32.71 60.71 315 top
R70  0Ω  [R0603_2]  79.62 56.4 90 bottom
R71  240  [r0402-nsk]  72.89 62.93 270 bottom
R72  240  [r0402-nsk]  70.74 63.03 270 bottom
R73  10K  [R0402#2]  74.52 41.91 0 top
R74  10K  [R0402#2]  66.7 34.65 90 bottom
R75  10K  [R0402#2]  67.51 37.85 225 bottom
R76  47K  [R0402#2]  65.38 32.77 135 bottom
R77  NC  [R0402_1]  83.52 75.69 90 top
R78  NC  [R0402_1]  72.95 73.05 270 top
R79  NC  [R0402_1]  71.98 73.05 90 top
R80  22  [R0402#2]  19.81 59.49 180 top
R81  22  [R0402#2]  13.72 59.49 180 top
R82  1K  [R0402#2]  4.18 63.9 180 top
R83  1K  [R0402#2]  4.15 62.33 180 top
R84  1K  [R0402#2]  4.12 60.83 0 top
R85  3.24K  [R0603]  3.2 37.9 180 top
R164  30kΩ  [R0402_1]  9.03 45.47 90 top
R166  47kΩ  [R0402_1]  9.02 47.23 90 top
R167  33kΩ  [R0402_1]  11.58 49.78 180 top
R168  150kΩ  [R0402_2]  11.58 51.71 0 top
R169  2K  [R0402#2]  15.6 44.04 90 bottom
R170  2K  [R0402#2]  16.66 44.04 90 bottom
R171  10K  [R0402#2]  77.62 36.17 270 bottom
R173  2.2K  [R0402#2]  95.55 96.57 270 top
R174  2.2K  [R0402#2]  96.93 96.57 270 top
R175  2.2K  [R0402#2]  16.92 96.22 90 bottom
R176  2.2K  [R0402#2]  15.9 96.22 90 bottom
R214  10K  [R0402#2]  45.57 78.97 180 top
R215  1.8K  [R0402#2]  45.42 84.23 0 top
R216  10K  [R0402#2]  49.15 78.97 180 top
R217  1.8K  [R0402#2]  48.16 84.23 180 top
R218  27K  [R0402#2]  41.55 78.97 180 top
R219  1K  [R0402#2]  45.11 88.09 180 top
R220  100K  [R0402#2]  45.11 87.07 180 top
R320  10K  [R0402#2]  67.36 85.19 0 bottom
R321  3.6R  [R0603]  75.94 84.58 90 bottom
R322  3.6R  [R0603]  74.48 84.56 90 bottom
R323  0  [R0603]  83.92 7.87 180 bottom
R325  2.2  [R0402#2]  53.15 10.87 270 top
R326  2.2  [R0402#2]  52.1 10.85 270 top
R327  NC  [R0805]  30.94 5.08 90 bottom
R328  100kΩ  [R0402_1]  35.76 4.47 270 bottom
R329  4.7kΩ  [R0402_1]  35.76 6.25 90 bottom
R336  10K  [R0402#2]  46.59 8.26 0 top
R337  20K  [R0402#2]  46.63 9.42 180 top
R342  1.8K  [R0402#2]  75.22 33.27 270 top
R343  510R  [R0402#2]  77.52 35.46 90 top
R344  510R  [R0402#2]  78.84 19.66 270 top
R345  2.49K  [R0402#2]  80.87 20.78 270 top
R346  22  [R0402#2]  65.45 27.24 180 top
R347  22  [R0402#2]  65.45 28.19 180 top
R348  22  [R0402#2]  65.45 29.24 180 top
R349  22  [R0402#2]  65.45 30.29 180 top
R350  22  [R0402#2]  65.45 25.17 180 top
R351  22  [R0402#2]  65.45 26.22 180 top
R352  4.7K  [R0402#2]  70 21.95 270 top
R353  4.7K/nc  [R0402#2]  72.03 21.95 270 top
R354  4.7K  [R0402#2]  71.02 21.95 90 top
R355  4.7K/nc  [R0402#2]  69.99 20.06 270 top
R356  4.7K  [R0402#2]  72.03 20.09 270 top
R357  4.7K  [R0402#2]  67.31 26.21 180 top
R358  4.7K  [R0402#2]  67.36 30.28 0 bottom
R359  4.7K  [R0402#2]  67.33 25.23 0 bottom
R360  4.7K/nc  [R0402#2]  67.31 30.28 180 top
R361  0  [R0603]  72.76 34.12 270 bottom
R362  0  [R0603]  79.91 35.1 0 top
R363  4.7K  [R0402#2]  79.76 33.88 0 top
R366  22  [R0402#2]  86.47 14.54 270 top
R367  22  [R0402#2]  85.39 14.54 270 top
R368  22  [R0402#2]  84.31 14.54 270 top
R369  22  [R0402#2]  81.58 14.58 270 top
R370  22  [R0402#2]  79.5 14.66 270 top
R371  22  [R0402#2]  78.49 14.66 270 top
R372  100  [R0402#2]  77.34 14.66 270 top
R374  10K  [R0603]  3.2 39.22 0 top
R375  0  [R0402#2]  36.47 18.74 270 top
R376  0  [R0402#2]  35.53 18.74 270 top
R377  100  [R0402#2]  24.89 93.98 270 top
R378  100  [R0402#2]  22.05 94.03 270 top
R379  0  [R0402#2]  5.46 85.26 180 top
R380  0  [R0402#2]  8.51 85.13 180 top
R381  0  [R0402#2]  2.56 85.18 180 top
R382  5.1K  [R0402#2]  48.78 9.42 0 top
R383  5.1K  [R0402#2]  56.17 9.33 180 top
RF1  6GHz  [IPEX-SMD_BWIPX-1-001E]  97.08 85.29 0 top
RST  -  [Key_SMD_4.2x3.2x2.5]  20.45 54.91 90 top
RST1  -  [Key_SMD_4.2x3.2x2.5]  78.94 38.97 0 top
RST2  -  [Key_SMD_4.2x3.2x2.5]  8.51 55.04 90 top
U1  24MHz  [CRYSTAL-SMD_4P-L3.2-W2.5-BL]  32.54 53.27 135 top
U2  -  [TCS4525]  19.3 42.27 0 top
U3  -  [fbga-153_l13.0-w11.5-p0.50_klmag1jetd-b041]  64.77 37.44 90 top
U4  -  [BGA-636_L19.0-W19.0-P0.65-BL]  50.54 57.57 225 top
U5  -  [RK809-5]  17.5 72.72 180 top
U6  -  [LPDDR4_MrX]  71.74 56.17 0 top
U7  NC  [SOT-23-5_L3.0-W1.7-P0.95-LS2.8-BR]  80.06 73.96 90 top
U8  ESD5451N  [X1-DFN1006-2_L1.0-W0.6-P0.65-BI]  19.81 58.44 0 top
U9  ESD5451N  [X1-DFN1006-2_L1.0-W0.6-P0.65-BI]  13.66 58.44 0 top
U10  ESD5451N  [X1-DFN1006-2_L1.0-W0.6-P0.65-BI]  74.57 39.93 180 top
U11  ESD5451N  [X1-DFN1006-2_L1.0-W0.6-P0.65-BI]  7.85 58.44 0 top
U12  ESD5311X  [DFN1006-2L-BI]  93.12 58.42 180 bottom
U13  ESD5311X  [DFN1006-2L-BI]  93.07 61.01 180 bottom
U14  ESD5341N  [DFN1006-2L-BI_1]  3.4 72.54 180 top
U15  CH224K  [ESSOP-10_L4.9-W3.9-P1.0-LS6.0-TL-EP]  11.07 21.44 180 top
U16  BSMD1206-100-13.2V  [F1206]  4.06 24.28 0 top
U17  ZX-MX1.25-2PLT  [CONN-SMD_2P-P1.25-MX1.25-2P-LT#2]  16.16 88.28 180 top
U18  ESD5341N  [DFN1006-2L-BI_1]  17.12 85.19 180 top
U19  ESD5341N  [DFN1006-2L-BI_1]  15.19 85.19 0 top
U20  ZX-MX1.25-2PLT  [CONN-SMD_2P-P1.25-MX1.25-2P-LT]  71.63 95.5 0 top
U26  SY8113BADC  [TSOT-23-6_L2.9-W1.6-P0.95-LS2.8-BR]  12.19 47.19 90 top
U27  TPS5430DDAR  [ESOP-8_L4.9-W3.9-P1.27-LS6.0-TL-EP]  4.42 33.17 270 top
U50  -  [RTL8211F-CG]  77.08 26.05 180 top
U52  ESD5341N  [DFN1006-2L-BI_1]  85.39 14.49 270 bottom
U53  ESD5341N  [DFN1006-2L-BI_1]  84.29 14.49 270 bottom
U54  ESD5341N  [DFN1006-2L-BI_1]  81.62 14.59 270 bottom
U55  ESD5341N  [DFN1006-2L-BI_1]  79.5 14.59 270 bottom
U56  ESD5341N  [DFN1006-2L-BI_1]  78.53 14.71 270 bottom
U57  ESD5341N  [DFN1006-2L-BI_1]  86.49 14.49 270 bottom
U58  X05C2015GZ  [FPC-SMD_15P-P0.50_XKB_X05C2015GZ]  87.88 96.82 0 top
U69  -  [BL_M8800DU6_40L]  98.35 80.47 270 top
U73  ESD5311X  [DFN1006-2L-BI]  51.71 9.28 180 top
U74  ESD5311X  [DFN1006-2L-BI]  53.54 9.24 0 top
U77  ESD5311X  [DFN1006-2L-BI]  22.05 94.03 270 bottom
U78  SY6280AAC  [SOT-23-5_L3.0-W1.7-P0.95-LS2.8-BL]  33.63 5.18 0 bottom
U79  SY7201ABC  [SOT-23-6_L2.9-W1.6-P0.95-LS2.8-BR]  71.03 86.31 0 bottom
U80  ESD5341N  [DFN1006-2L-BI_1]  77.38 14.71 270 bottom
U81  ESD5311X  [DFN1006-2L-BI]  24.89 93.98 270 bottom
U82  ESD5341N  [DFN1006-2L-BI_1]  8.55 86.19 180 top
U83  ESD5341N  [DFN1006-2L-BI_1]  5.42 86.14 180 top
U84  ESD5341N  [DFN1006-2L-BI_1]  2.41 86.28 180 top
USB1  -  [USB_TYPE-C-16P]  3.81 17.42 270 top
USB2  -  [USB_TYPE-C-16P]  51.97 3.96 0 top
USB3  USB-301WD-ARY  [USB-TH_XUNPU_USB-301WD-ARY]  35.1 10.41 0 top
X1  32.768kHz  [CRYSTAL-SMD_L3.2-W1.5-1]  9.5 67.61 90 top
X2  25MHz  [CRYSTAL-SMD_4P-L3.2-W2.5-BL_1]  76.02 21.27 180 top

## Footprints (pads in the part's own frame, mm; a bottom-side part is the same pattern mirrored in y, then rotated)
AUDIO-SMD_PJ-313D-2
  rect 2.5x1.25 smd: 1(-3.6,3.205) 1(3.6,3.205) 2(-3.6,-0.005) 2(3.6,-0.005) 3(-3.6,-3.205) 3(3.6,-3.205)
BGA-636_L19.0-W19.0-P0.65-BL
  round 0.254 smd: A1(-8.844,8.886) A2(-8.194,8.885) A3(-7.544,8.886) A4(-6.894,8.885) A5(-6.244,8.886) A6(-5.594,8.885) A7(-4.944,8.886) A8(-4.294,8.885) A9(-3.644,8.886) A10(-2.994,8.885) A11(-2.344,8.886) A12(-1.694,8.885) A13(-1.044,8.886) A14(-0.395,8.886) A15(0.256,8.886) A16(0.906,8.886) A17(1.556,8.885) A18(2.206,8.886) A19(2.856,8.885) A20(3.506,8.886) A21(4.156,8.885) A22(4.806,8.886) A23(5.456,8.885) A24(6.106,8.886) A25(6.756,8.885) A26(7.406,8.886) A27(8.056,8.885) A28(8.706,8.886) AA1(-8.844,-4.114) AA2(-8.194,-4.114) AA3(-7.544,-4.114) AA4(-6.894,-4.114) AA5(-6.244,-4.114) AA6(-5.594,-4.114) AA7(-4.944,-4.115) AA9(-3.644,-4.114) AA11(-2.345,-4.114) AA12(-1.694,-4.114) AA14(-0.394,-4.114) AA15(0.256,-4.114) AA17(1.556,-4.114) AA18(2.206,-4.114) AA20(3.506,-4.114) AA22(4.806,-4.115) AA23(5.456,-4.114) AA24(6.106,-4.114) AA25(6.756,-4.114) AA26(7.405,-4.114) AA27(8.056,-4.114) AA28(8.706,-4.114) AB1(-8.844,-4.764) AB2(-8.194,-4.764) AB5(-6.244,-4.764) AB6(-5.594,-4.764) AB8(-4.295,-4.764) AB9(-3.644,-4.764) AB11(-2.344,-4.764) AB12(-1.694,-4.764) AB14(-0.395,-4.764) AB15(0.256,-4.764) AB17(1.556,-4.764) AB18(2.206,-4.764) AB20(3.506,-4.764) AB21(4.156,-4.764) AB23(5.455,-4.764) AB24(6.106,-4.764) AB27(8.056,-4.764) AB28(8.706,-4.764) AC1(-8.844,-5.415) AC2(-8.194,-5.415) AC3(-7.544,-5.415) AC4(-6.894,-5.415) AC5(-6.244,-5.415) AC7(-4.944,-5.415) AC8(-4.294,-5.415) AC9(-3.644,-5.415) AC11(-2.345,-5.415) AC12(-1.694,-5.415) AC14(-0.394,-5.415) AC15(0.256,-5.415) AC17(1.556,-5.415) AC18(2.206,-5.415) AC20(3.506,-5.415) AC21(4.156,-5.415) AC22(4.806,-5.415) AC24(6.106,-5.415) AC25(6.756,-5.415) AC26(7.405,-5.415) AC27(8.056,-5.415) AC28(8.706,-5.415) AD1(-8.844,-6.064) AD2(-8.194,-6.064) AD3(-7.544,-6.065) AD4(-6.894,-6.064) AD6(-5.594,-6.064) AD7(-4.944,-6.064) AD8(-4.294,-6.065) AD9(-3.644,-6.064) AD11(-2.344,-6.064) AD12(-1.694,-6.065) AD14(-0.395,-6.064) AD15(0.256,-6.064) AD17(1.556,-6.064) AD18(2.206,-6.065) AD20(3.506,-6.064) AD21(4.156,-6.064) AD22(4.806,-6.064) AD23(5.456,-6.064) AD25(6.755,-6.064) AD26(7.406,-6.064) AD27(8.056,-6.064) AD28(8.706,-6.064) AE1(-8.844,-6.715) AE2(-8.194,-6.715) AE3(-7.544,-6.715) AE5(-6.244,-6.715) AE6(-5.594,-6.715) AE8(-4.294,-6.715) AE9(-3.644,-6.715) AE11(-2.345,-6.715) AE12(-1.694,-6.715) AE14(-0.394,-6.715) AE15(0.256,-6.715) AE17(1.556,-6.715) AE18(2.206,-6.715) AE20(3.506,-6.715) AE21(4.156,-6.715) AE23(5.456,-6.715) AE24(6.106,-6.714) AE26(7.405,-6.715) AE27(8.056,-6.715) AE28(8.706,-6.715) AF1(-8.844,-7.364) AF2(-8.194,-7.364) AF3(-7.544,-7.364) AF4(-6.894,-7.364) AF5(-6.244,-7.364) AF6(-5.594,-7.364) AF8(-4.294,-7.364) AF9(-3.644,-7.364) AF11(-2.344,-7.364) AF12(-1.694,-7.364) AF14(-0.395,-7.364) AF15(0.256,-7.364) AF17(1.556,-7.364) AF18(2.206,-7.364) AF20(3.506,-7.364) AF21(4.156,-7.364) AF23(5.456,-7.364) AF24(6.106,-7.364) AF25(6.756,-7.364) AF26(7.406,-7.364) AF27(8.056,-7.364) AF28(8.706,-7.364) AG1(-8.844,-8.014) AG2(-8.194,-8.014) AG3(-7.544,-8.014) AG4(-6.894,-8.014) AG5(-6.244,-8.014) AG6(-5.594,-8.014) AG7(-4.944,-8.014) AG8(-4.294,-8.014) AG9(-3.644,-8.014) AG10(-2.994,-8.014) AG11(-2.344,-8.014) AG12(-1.694,-8.014) AG13(-1.044,-8.014) AG14(-0.394,-8.014) AG15(0.256,-8.014) AG16(0.906,-8.014) AG17(1.556,-8.014) AG18(2.206,-8.014) AG19(2.856,-8.014) AG20(3.506,-8.014) AG21(4.156,-8.014) AG22(4.806,-8.014) AG23(5.456,-8.014) AG24(6.106,-8.014) AG25(6.756,-8.014) AG26(7.406,-8.014) AG27(8.056,-8.014) AG28(8.706,-8.014) AH1(-8.844,-8.665) AH2(-8.194,-8.665) AH3(-7.544,-8.665) AH4(-6.894,-8.665) AH5(-6.244,-8.665) AH6(-5.594,-8.665) AH7(-4.944,-8.665) AH8(-4.294,-8.665) AH9(-3.644,-8.665) AH10(-2.994,-8.665) AH11(-2.344,-8.665) AH12(-1.694,-8.665) AH13(-1.044,-8.665) AH14(-0.395,-8.665) AH15(0.256,-8.665) AH16(0.906,-8.665) AH17(1.556,-8.665) AH18(2.206,-8.665) AH19(2.856,-8.665) AH20(3.506,-8.665) AH21(4.156,-8.665) AH22(4.806,-8.665) AH23(5.456,-8.665) AH24(6.106,-8.665) AH25(6.756,-8.665) AH26(7.406,-8.665) AH27(8.056,-8.665) AH28(8.706,-8.665) B1(-8.844,8.236) B2(-8.194,8.236) B3(-7.544,8.235) B4(-6.894,8.236) B5(-6.244,8.235) B6(-5.594,8.236) B7(-4.944,8.235) B8(-4.294,8.235) B9(-3.644,8.235) B10(-2.994,8.236) B11(-2.344,8.235) B12(-1.694,8.236) B13(-1.044,8.236) B14(-0.394,8.236) B15(0.256,8.236) B16(0.906,8.236) B17(1.556,8.236) B18(2.206,8.235) B19(2.856,8.236) B20(3.506,8.235) B21(4.156,8.236) B22(4.806,8.235) B23(5.456,8.235) B24(6.106,8.235) B25(6.756,8.235) B26(7.406,8.235) B27(8.056,8.236) B28(8.706,8.236) C1(-8.844,7.585) C2(-8.194,7.585) C3(-7.544,7.585) C4(-6.894,7.585) C5(-6.244,7.585) C6(-5.594,7.585) C8(-4.294,7.585) C9(-3.644,7.585) C11(-2.344,7.585) C12(-1.694,7.585) C14(-0.395,7.585) C15(0.256,7.585) C17(1.556,7.585) C18(2.206,7.585) C20(3.506,7.585) C21(4.156,7.585) C23(5.456,7.585) C24(6.106,7.585) C25(6.756,7.585) C26(7.406,7.585) C27(8.056,7.585) C28(8.706,7.585) D1(-8.844,6.936) D2(-8.194,6.936) D3(-7.544,6.936) D5(-6.244,6.936) D6(-5.594,6.936) D8(-4.294,6.936) D9(-3.644,6.936) D11(-2.345,6.936) D12(-1.694,6.936) D14(-0.394,6.936) D15(0.256,6.936) D17(1.556,6.936) D18(2.206,6.936) D20(3.506,6.936) D21(4.156,6.936) D23(5.456,6.936) D24(6.106,6.936) D26(7.405,6.936) D27(8.056,6.936) D28(8.706,6.936) E1(-8.844,6.285) E2(-8.194,6.285) E3(-7.544,6.285) E4(-6.894,6.285) E6(-5.594,6.285) E7(-4.944,6.285) E8(-4.294,6.285) E9(-3.644,6.285) E11(-2.344,6.285) E12(-1.694,6.285) E14(-0.395,6.285) E15(0.256,6.285) E17(1.556,6.285) E18(2.206,6.285) E20(3.506,6.285) E21(4.156,6.285) E22(4.806,6.285) E23(5.456,6.285) E25(6.755,6.285) E26(7.406,6.285) E27(8.056,6.285) E28(8.706,6.285) F1(-8.844,5.636) F2(-8.194,5.636) F3(-7.544,5.636) F4(-6.894,5.636) F5(-6.244,5.636) F7(-4.944,5.636) F8(-4.294,5.636) F9(-3.644,5.636) F11(-2.345,5.636) F12(-1.694,5.636) F14(-0.394,5.636) F15(0.256,5.636) F17(1.556,5.636) F18(2.206,5.636) F20(3.506,5.636) F21(4.156,5.636) F22(4.806,5.636) F24(6.106,5.636) F25(6.756,5.636) F26(7.405,5.636) F27(8.056,5.636) F28(8.706,5.636) G1(-8.844,4.985) G2(-8.194,4.986) G5(-6.244,4.986) G6(-5.594,4.986) G8(-4.295,4.986) G9(-3.644,4.986) G11(-2.344,4.986) G12(-1.694,4.985) G14(-0.395,4.985) G15(0.256,4.986) G17(1.556,4.986) G18(2.206,4.985) G20(3.506,4.985) G21(4.156,4.986) G23(5.455,4.986) G24(6.106,4.986) G27(8.056,4.986) G28(8.706,4.985) H1(-8.844,4.335) H2(-8.194,4.335) H3(-7.544,4.335) H4(-6.894,4.335) H5(-6.244,4.335) H6(-5.594,4.335) H7(-4.944,4.335) H9(-3.644,4.335) H11(-2.345,4.335) H12(-1.694,4.335) H14(-0.394,4.335) H15(0.256,4.335) H17(1.556,4.335) H18(2.206,4.335) H20(3.506,4.335) H22(4.806,4.335) H23(5.456,4.335) H24(6.106,4.335) H25(6.756,4.335) H26(7.405,4.335) H27(8.056,4.335) H28(8.706,4.335) J1(-8.844,3.686) J2(-8.194,3.686) J3(-7.544,3.686) J4(-6.894,3.686) J5(-6.244,3.686) J6(-5.594,3.686) J7(-4.944,3.686) J8(-4.294,3.686) J9(-3.644,3.686) J11(-2.344,3.686) J12(-1.694,3.686) J14(-0.395,3.686) J15(0.256,3.686) J17(1.556,3.686) J18(2.206,3.686) J20(3.506,3.686) J21(4.156,3.686) J22(4.806,3.686) J23(5.456,3.686) J24(6.106,3.686) J25(6.755,3.686) J26(7.406,3.686) J27(8.056,3.686) J28(8.706,3.686) K1(-8.844,3.035) K2(-8.194,3.036) K10(-2.994,3.035) K11(-2.345,3.035) K12(-1.694,3.036) K13(-1.044,3.036) K14(-0.394,3.036) K15(0.256,3.035) K16(0.906,3.035) K17(1.556,3.035) K18(2.206,3.035) K19(2.856,3.036) K27(8.056,3.035) K28(8.706,3.036) L1(-8.844,2.385) L2(-8.194,2.385) L3(-7.544,2.385) L4(-6.894,2.385) L5(-6.244,2.385) L6(-5.594,2.385) L7(-4.944,2.385) L8(-4.294,2.385) L9(-3.644,2.385) L10(-2.994,2.385) L11(-2.344,2.385) L12(-1.694,2.385) L13(-1.044,2.385) L14(-0.395,2.385) L15(0.256,2.385) L16(0.906,2.385) L17(1.556,2.385) L18(2.206,2.385) L19(2.856,2.385) L20(3.506,2.385) L21(4.156,2.385) L22(4.806,2.385) L23(5.456,2.385) L24(6.106,2.385) L25(6.756,2.385) L26(7.406,2.385) L27(8.056,2.385) L28(8.706,2.385) M1(-8.844,1.736) M2(-8.194,1.736) M3(-7.544,1.736) M4(-6.894,1.736) M5(-6.244,1.736) M6(-5.594,1.736) M7(-4.944,1.736) M8(-4.294,1.736) M9(-3.644,1.736) M10(-2.994,1.736) M11(-2.344,1.736) M12(-1.694,1.736) M13(-1.044,1.736) M14(-0.394,1.736) M15(0.256,1.736) M16(0.906,1.736) M17(1.556,1.736) M18(2.206,1.736) M19(2.856,1.736) M20(3.506,1.736) M21(4.156,1.736) M22(4.806,1.736) M23(5.456,1.736) M24(6.106,1.736) M25(6.756,1.736) M26(7.406,1.736) M27(8.056,1.736) M28(8.706,1.736) N1(-8.844,1.085) N2(-8.194,1.085) N10(-2.994,1.085) N11(-2.344,1.085) N12(-1.694,1.085) N13(-1.044,1.085) N14(-0.395,1.085) N15(0.256,1.085) N16(0.906,1.085) N17(1.556,1.085) N18(2.206,1.085) N19(2.856,1.085) N27(8.056,1.085) N28(8.706,1.085) P1(-8.844,0.435) P2(-8.194,0.435) P3(-7.544,0.435) P4(-6.894,0.435) P5(-6.244,0.435) P6(-5.594,0.435) P7(-4.944,0.435) P8(-4.294,0.435) P9(-3.644,0.435) P10(-2.994,0.435) P11(-2.344,0.435) P12(-1.694,0.435) P13(-1.044,0.435) P14(-0.394,0.435) P15(0.256,0.435) P16(0.906,0.435) P17(1.556,0.435) P18(2.206,0.435) P19(2.856,0.435) P20(3.506,0.435) P21(4.156,0.435) P22(4.806,0.435) P23(5.456,0.435) P24(6.106,0.435) P25(6.756,0.435) P26(7.406,0.435) P27(8.056,0.435) P28(8.706,0.435) R1(-8.844,-0.215) R2(-8.194,-0.214) R3(-7.544,-0.215) R4(-6.894,-0.214) R5(-6.244,-0.215) R6(-5.594,-0.214) R7(-4.944,-0.215) R8(-4.294,-0.214) R9(-3.644,-0.215) R10(-2.994,-0.214) R11(-2.344,-0.215) R12(-1.694,-0.214) R13(-1.044,-0.215) R14(-0.394,-0.214) R15(0.256,-0.214) R16(0.906,-0.215) R17(1.556,-0.214) R18(2.206,-0.215) R19(2.856,-0.214) R20(3.506,-0.215) R21(4.156,-0.214) R22(4.806,-0.215) R23(5.456,-0.214) R24(6.106,-0.215) R25(6.756,-0.214) R26(7.406,-0.215) R27(8.056,-0.214) R28(8.706,-0.215) T1(-8.844,-0.865) T2(-8.194,-0.865) T10(-2.994,-0.865) T11(-2.344,-0.865) T12(-1.694,-0.865) T13(-1.044,-0.865) T14(-0.395,-0.865) T15(0.256,-0.865) T16(0.906,-0.865) T17(1.556,-0.865) T18(2.206,-0.865) T19(2.856,-0.865) T27(8.056,-0.865) T28(8.706,-0.865) U1(-8.844,-1.514) U2(-8.194,-1.514) U3(-7.544,-1.515) U4(-6.894,-1.514) U5(-6.244,-1.515) U6(-5.594,-1.514) U7(-4.944,-1.515) U8(-4.294,-1.514) U9(-3.644,-1.515) U10(-2.994,-1.514) U11(-2.344,-1.515) U12(-1.694,-1.514) U13(-1.044,-1.514) U14(-0.394,-1.514) U15(0.256,-1.514) U16(0.906,-1.514) U17(1.556,-1.514) U18(2.206,-1.515) U19(2.856,-1.514) U20(3.506,-1.515) U21(4.156,-1.514) U22(4.806,-1.515) U23(5.456,-1.514) U24(6.106,-1.515) U25(6.756,-1.514) U26(7.406,-1.515) U27(8.056,-1.514) U28(8.706,-1.514) V1(-8.844,-2.164) V2(-8.194,-2.165) V3(-7.544,-2.164) V4(-6.894,-2.165) V5(-6.244,-2.164) V6(-5.594,-2.165) V7(-4.944,-2.165) V8(-4.294,-2.165) V9(-3.644,-2.165) V10(-2.994,-2.165) V11(-2.344,-2.164) V12(-1.694,-2.164) V13(-1.044,-2.164) V14(-0.395,-2.164) V15(0.256,-2.164) V16(0.906,-2.164) V17(1.556,-2.164) V18(2.206,-2.164) V19(2.856,-2.165) V20(3.506,-2.164) V21(4.156,-2.165) V22(4.806,-2.164) V23(5.456,-2.165) V24(6.106,-2.165) V25(6.756,-2.165) V26(7.406,-2.164) V27(8.056,-2.164) V28(8.706,-2.164) W1(-8.844,-2.814) W2(-8.194,-2.814) W10(-2.994,-2.814) W11(-2.345,-2.814) W12(-1.694,-2.814) W13(-1.044,-2.814) W14(-0.394,-2.814) W15(0.256,-2.814) W16(0.906,-2.814) W17(1.556,-2.814) W18(2.206,-2.814) W19(2.856,-2.814) W27(8.056,-2.814) W28(8.706,-2.814) Y1(-8.844,-3.465) Y2(-8.194,-3.464) Y3(-7.544,-3.465) Y4(-6.894,-3.465) Y5(-6.244,-3.465) Y6(-5.594,-3.465) Y7(-4.944,-3.465) Y8(-4.294,-3.465) Y9(-3.644,-3.465) Y11(-2.344,-3.465) Y12(-1.694,-3.465) Y14(-0.395,-3.465) Y15(0.256,-3.465) Y17(1.556,-3.465) Y18(2.206,-3.465) Y20(3.506,-3.465) Y21(4.156,-3.465) Y22(4.806,-3.465) Y23(5.456,-3.465) Y24(6.106,-3.464) Y25(6.755,-3.465) Y26(7.406,-3.465) Y27(8.056,-3.465) Y28(8.706,-3.465)
BL_M8800DU6_40L
  rect 3x1.3 smd: 1(-0.25,-2.4) 2(-0.25,-4.4) 3(12.55,-11.7) 4(12.55,-8.9) 5(12.55,-5.4) 6(12.55,-2.9)
  rect 1x1 smd: 7(2.4,-4.4) 8(9.9,-10.9) 9(7.7,-12.4) 10(9.2,-12.4)
C0201
  rect 0.368x0.324 smd: 1(-0.275,0) 2(0.275,0)
C0402
  rect 0.566x0.54 smd: 1(-0.433,0) 2(0.433,0)
c0402-nsk
  rect 0.559x0.559 smd: 1(-0.508,0) 2(0.508,0)
C0402_1
  rect 0.79x0.54 smd: 1(-0.545,0) 2(0.545,0)
C0603
  rect 0.8x0.9 smd: 1(-0.7,0) 2(0.7,0)
c0603-nsk
  rect 0.85x0.85 smd: 1(-0.75,0) 2(0.75,0)
C0603_1
  rect 0.8x0.9 smd: 1(-0.7,0) 2(0.7,0)
C0603_2
  rect 0.8x0.9 smd: 1(-0.7,0) 2(0.7,0)
C1206
  rect 1.485x1.728 smd: 1(-1.593,0) 2(1.593,0)
CAP-SMD_BD6.3-L6.6-W6.6-RD
  rect 3.26x1.15 smd: 1(2.555,0) 2(-2.555,0)
CONN-SMD_2P-P1.25-MX1.25-2P-LT
  rect 0.8x1.6 smd: 1(-0.625,1.45) 2(0.625,1.45)
  rect 2.1x3 smd: 3(-3.175,-1.45) 4(3.175,-1.45)
CONN-SMD_2P-P1.25-MX1.25-2P-LT#2
  rect 0.8x1.6 smd: 1(0.625,1.45) 2(-0.625,1.45)
  rect 2.1x3 smd: 3(3.175,-1.45) 4(-3.175,-1.45)
CRYSTAL-SMD_4P-L3.2-W2.5-BL
  rect 1.4x1.2 smd: 1(-1.1,-0.85) 2(1.1,-0.85) 3(1.1,0.85) 4(-1.1,0.85)
CRYSTAL-SMD_4P-L3.2-W2.5-BL_1
  rect 1.4x1.2 smd: 1(-1.1,-0.85) 2(1.1,-0.85) 3(1.1,0.85) 4(-1.1,0.85)
CRYSTAL-SMD_L3.2-W1.5-1
  rect 1.05x1.7 smd: 1(-1.275,0) 2(1.275,0)
DFN1006-2L-BI
  rect 0.55x0.6 smd: 1(-0.425,0) 2(0.425,0)
DFN1006-2L-BI_1
  rect 0.45x0.55 smd: 1(-0.425,0) 2(0.425,0)
DFN-10_L2.5-W1.0-P0.50-BL-2
  rect 0.2x0.675 smd: 1(-1,-0.44) 2(-0.5,-0.44) 4(0.5,-0.44) 5(1,-0.44) 6(1,0.44) 7(0.5,0.44) 9(-0.5,0.44) 10(-1,0.44)
  rect 0.4x0.675 smd: 3(0,-0.44) 8(0,0.44)
ESOP-8_L4.9-W3.9-P1.27-LS6.0-TL-EP
  rect 1.3x0.6 smd: 1(-2.7,1.905) 2(-2.7,0.635) 3(-2.7,-0.635) 4(-2.7,-1.905) 5(2.7,-1.905) 6(2.7,-0.635) 7(2.7,0.635) 8(2.7,1.905)
  rect 2.5x3.5 smd: 9(0,0)
ESSOP-10_L4.9-W3.9-P1.0-LS6.0-TL-EP
  rect 0.6x1.5 smd: 1(-2,-3) 2(-1,-3) 3(0,-3) 4(1,-3) 5(2,-3) 6(2,3) 7(1,3) 8(0,3) 9(-1,3) 10(-2,3)
  rect 3.3x2.1 smd: 11(0,0)
F0805
  rect 1.335x1.5 smd: 1(-1.143,0) 2(1.143,0)
F1206
  rect 1.19x1.728 smd: 1(-1.445,0) 2(1.445,0)
fbga-153_l13.0-w11.5-p0.50_klmag1jetd-b041
  round 0.25 smd: A1(-3.25,3.25) A3(-2.25,3.25) A4(-1.75,3.25) A5(-1.25,3.25) A6(-0.75,3.25) A8(0.25,3.25) A9(0.75,3.25) A10(1.25,3.25) A11(1.75,3.25) A12(2.25,3.25) A13(2.75,3.25) A14(3.25,3.25) B1(-3.25,2.75) B2(-2.75,2.75) B3(-2.25,2.75) B4(-1.75,2.75) B5(-1.25,2.75) B6(-0.75,2.75) B7(-0.25,2.75) B8(0.25,2.75) B9(0.75,2.75) B10(1.25,2.75) B11(1.75,2.75) B12(2.25,2.75) B13(2.75,2.75) B14(3.25,2.75) C2(-2.75,2.25) C3(-2.25,2.25) C4(-1.75,2.25) C6(-0.75,2.25) C7(-0.25,2.25) C8(0.25,2.25) C9(0.75,2.25) C10(1.25,2.25) C11(1.75,2.25) C12(2.25,2.25) C13(2.75,2.25) C14(3.25,2.25) D1(-3.25,1.75) D2(-2.75,1.75) D3(-2.25,1.75) D12(2.25,1.75) D13(2.75,1.75) D14(3.25,1.75) E1(-3.25,1.25) E2(-2.75,1.25) E6(-0.75,1.25) E7(-0.25,1.25) E8(0.25,1.25) E9(0.75,1.25) E10(1.25,1.25) E12(2.25,1.25) E13(2.75,1.25) E14(3.25,1.25) F1(-3.25,0.75) F2(-2.75,0.75) F3(-2.25,0.75) F5(-1.25,0.75) F10(1.25,0.75) F12(2.25,0.75) F13(2.75,0.75) F14(3.25,0.75) G1(-3.25,0.25) G2(-2.75,0.25) G3(-2.25,0.25) G5(-1.25,0.25) G13(2.75,0.25) G14(3.25,0.25) H1(-3.25,-0.25) H2(-2.75,-0.25) H3(-2.25,-0.25) H5(-1.25,-0.25) H10(1.25,-0.25) H12(2.25,-0.25) H13(2.75,-0.25) H14(3.25,-0.25) J1(-3.25,-0.75) J2(-2.75,-0.75) J3(-2.25,-0.75) J5(-1.25,-0.75) J10(1.25,-0.75) J12(2.25,-0.75) J13(2.75,-0.75) J14(3.25,-0.75) K1(-3.25,-1.25) K2(-2.75,-1.25) K3(-2.25,-1.25) K5(-1.25,-1.25) K6(-0.75,-1.25) K7(-0.25,-1.25) K8(0.25,-1.25) K9(0.75,-1.25) K10(1.25,-1.25) K12(2.25,-1.25) K13(2.75,-1.25) K14(3.25,-1.25) L1(-3.25,-1.75) L2(-2.75,-1.75) L3(-2.25,-1.75) L12(2.25,-1.75) L13(2.75,-1.75) L14(3.25,-1.75) M1(-3.25,-2.25) M2(-2.75,-2.25) M3(-2.25,-2.25) M4(-1.75,-2.25) M5(-1.25,-2.25) M6(-0.75,-2.25) M7(-0.25,-2.25) M8(0.25,-2.25) M9(0.75,-2.25) M10(1.25,-2.25) M11(1.75,-2.25) M12(2.25,-2.25) M13(2.75,-2.25) M14(3.25,-2.25) N1(-3.25,-2.75) N2(-2.75,-2.75) N3(-2.25,-2.75) N4(-1.75,-2.75) N5(-1.25,-2.75) N6(-0.75,-2.75) N7(-0.25,-2.75) N8(0.25,-2.75) N9(0.75,-2.75) N10(1.25,-2.75) N11(1.75,-2.75) N12(2.25,-2.75) N13(2.75,-2.75) N14(3.25,-2.75) P1(-3.25,-3.25) P2(-2.75,-3.25) P3(-2.25,-3.25) P4(-1.75,-3.25) P5(-1.25,-3.25) P6(-0.75,-3.25) P7(-0.25,-3.25) P8(0.25,-3.25) P9(0.75,-3.25) P10(1.25,-3.25) P11(1.75,-3.25) P12(2.25,-3.25) P13(2.75,-3.25) P14(3.25,-3.25)
FPC-SMD_6P-P0.50_XUNPU_FPC-05F-6PH20
  rect 0.3x1.25 smd: 1(-1.25,1.288) 2(-0.75,1.288) 3(-0.25,1.288) 4(0.25,1.288) 5(0.75,1.288) 6(1.25,1.288)
  rect 2x2.5 smd: 7(2.94,-1.288) 8(-2.94,-1.288)
FPC-SMD_15P-P0.50_XKB_X05C2015GZ
  rect 0.4x1.2 smd: 1(-3.5,-1) 2(-3,1) 3(-2.5,-1) 4(-2,1) 5(-1.5,-1) 6(-1,1) 7(-0.5,-1) 8(0,1) 9(0.5,-1) 10(1,1) 11(1.5,-1) 12(2,1) 13(2.5,-1) 14(3,1) 15(3.5,-1)
  rect 2x2.4 smd: 16(5.3,0) 17(-5.3,0)
FPC-SMD_24P-P0.50_AFC01-S24FCA-00
  rect 0.3x1.3 smd: 1(-5.75,1.325) 2(-5.25,1.325) 3(-4.75,1.325) 4(-4.25,1.325) 5(-3.75,1.325) 6(-3.25,1.325) 7(-2.75,1.325) 8(-2.25,1.325) 9(-1.75,1.325) 10(-1.25,1.325) 11(-0.75,1.325) 12(-0.25,1.325) 13(0.25,1.325) 14(0.75,1.325) 15(1.25,1.325) 16(1.75,1.325) 17(2.25,1.325) 18(2.75,1.325) 19(3.25,1.325) 20(3.75,1.325) 21(4.25,1.325) 22(4.75,1.325) 23(5.25,1.325) 24(5.75,1.325)
  rect 2x1.6 smd: 25(7.449,-1.325) 26(-7.45,-1.325)
FPC-SMD_31P-P0.30_HC-FPC-03-09-31RLTAG
  rect 0.3x0.67 smd: 1(4.5,1.532) 3(3.9,1.532) 5(3.3,1.532) 7(2.7,1.532) 9(2.1,1.532) 11(1.5,1.532) 13(0.9,1.532) 15(0.3,1.532) 17(-0.3,1.532) 19(-0.9,1.532) 21(-1.5,1.532) 23(-2.1,1.532) 25(-2.7,1.532) 27(-3.3,1.532) 29(-3.9,1.532) 31(-4.5,1.532)
  rect 0.3x0.5 smd: 2(4.2,-1.532) 4(3.6,-1.532) 6(3,-1.532) 8(2.4,-1.532) 10(1.8,-1.532) 12(1.2,-1.532) 14(0.6,-1.532) 16(0,-1.532) 18(-0.6,-1.532) 20(-1.2,-1.532) 22(-1.8,-1.532) 24(-2.4,-1.532) 26(-3,-1.532) 28(-3.6,-1.532) 30(-4.2,-1.532)
  rect 0.35x1 smd: 32(-5.475,1.268) 33(5.475,1.268)
HDMI-SMD_HDMI-19PIN-043
  rect 0.3x2.6 smd: 1(4.5,3.38) 2(4,3.38) 3(3.5,3.38) 4(3,3.38) 5(2.5,3.38) 6(2,3.38) 7(1.5,3.38) 8(1,3.38) 9(0.5,3.38) 10(0,3.38) 11(-0.5,3.38) 12(-1,3.38) 13(-1.5,3.38) 14(-2,3.38) 15(-2.5,3.38) 16(-3,3.38) 17(-3.5,3.38) 18(-4,3.38) 19(-4.5,3.38)
  oval 1.5x3.3 hole 0.7x2.5: 20(-7.25,2.62) 20(7.25,2.62)
  oval 1.5x2.3 hole 0.7x1.5: 20(-7.25,-3.38) 20(7.25,-3.38)
HDR-TH_2P-P2.54-V-M-1
  rect 1.8x1.8 hole 1.1: 1(-1.27,0)
  round 1.8 hole 1.1: 2(1.27,0)
HDR-TH_3P-P2.54-V-M
  rect 1.7x1.7 hole 1.1: 1(-2.54,0)
  round 1.7 hole 1.1: 2(0,0) 3(2.54,0)
IND-SMD_L2.0-W1.6_MHCHL201610A-1R0M-Q8A
  rect 0.8x2 smd: 1(-0.9,0) 2(0.9,0)
